# Altium project CryptUS_RevB.PrjPcb (part 1 of 2)
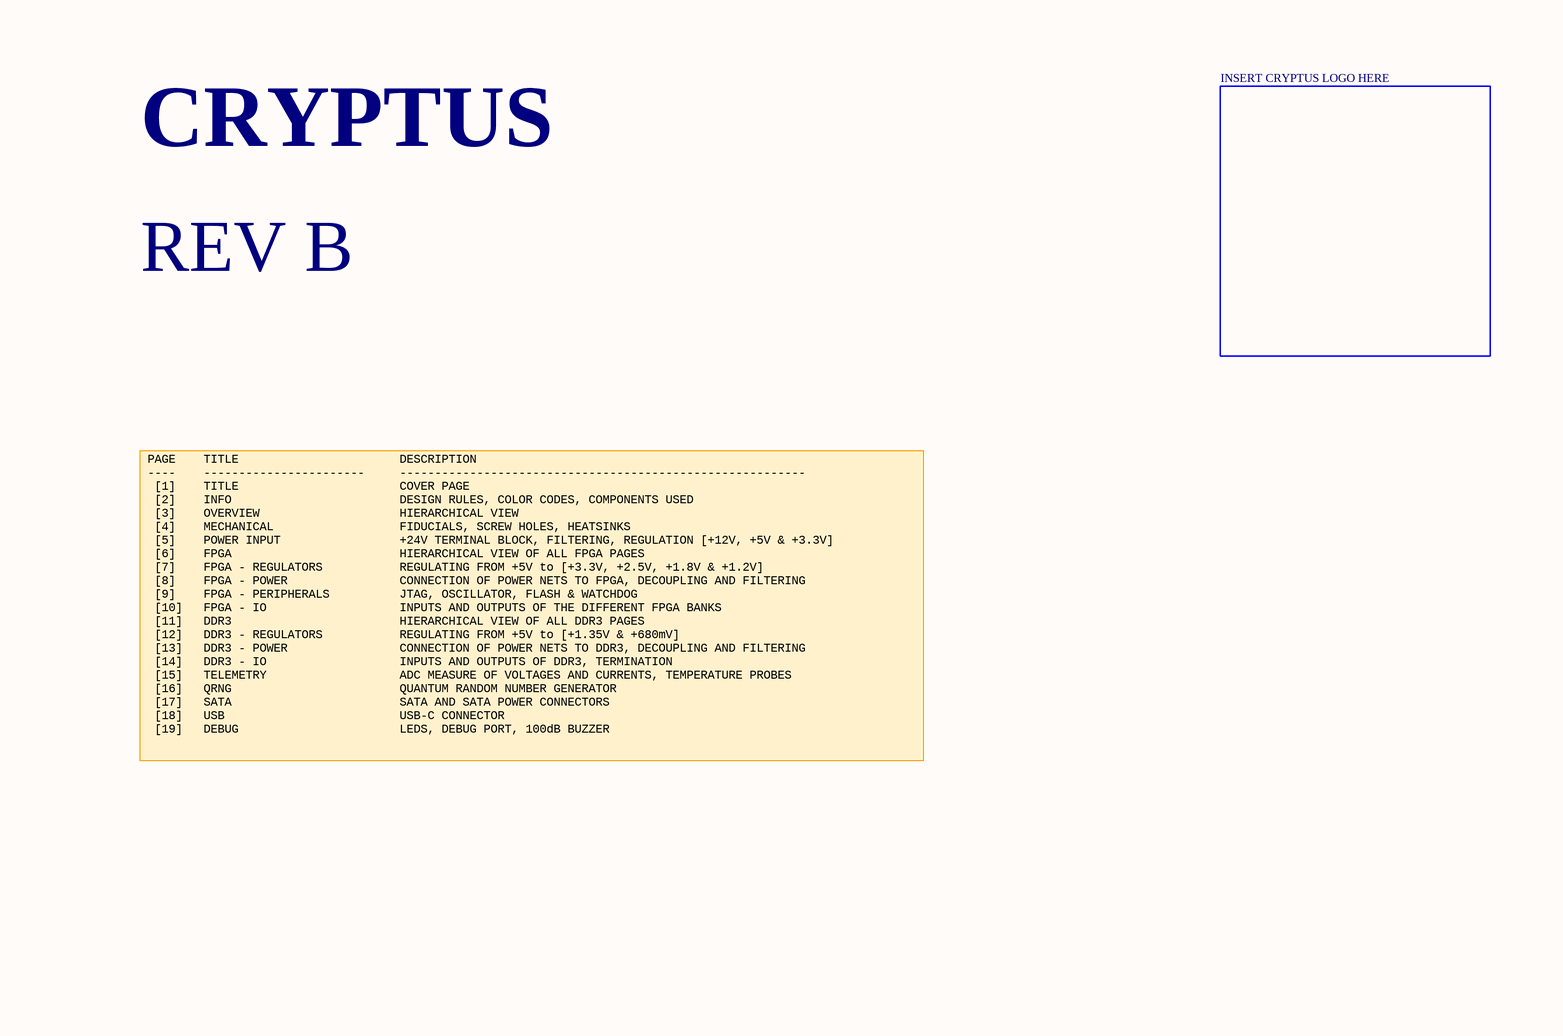
[diagram p0: TITLE.SchDoc]
Author: Pascal-Emmanuel Lachance; DOC_NO_ASSY_DWG: CryptUS_RevB_DWG.PCBDwf; DOC_NO_BOM: CryptUS_RevB_BOM.xslx; NotFitted: DNF; PCB_DWG_NO: CryptUS_RevB_PCB.PcbDoc; Project: CryptUS; Revision: B; SCH_SCALE: 1:1
19 sheets, 226 parts. Net scope: hierarchical (ports join the sheet entries above them; power ports are global).
Board file: CryptUS_RevB_PCB.PcbDoc
Sheets:
  TITLE.SchDoc
    INFO PAGE = INFO.SchDoc
    INSERT CRYPTUS LOGO HERE = OVERVIEW.SchDoc
      MECHANICAL = MECHANICAL.SchDoc
      POWER IN = POWER INPUT.SchDoc
      LATTICE ECP5 FPGA = FPGA.SchDoc
        [+5V] => [+3V3, +2V5, +1V8, +1V2] = FPGA - REGULATORS.SchDoc
        FPGA POWER INPUTS = FPGA - POWER.SchDoc
        FPGA IO BANKS = FPGA - IO.SchDoc
        JTAG, OSCILLATOR, FLASH & WATCHDOG = FPGA - PERIPHERALS.SchDoc
      8GB DDR3 = DDR3.SchDoc
        [+5V] => [+1V35, +VTT, +VREF] = DDR3 - REGULATORS.SchDoc
        DDR3 POWER INPUTS = DDR3 - POWER.SchDoc
        DDR3 IO & TERMINATIONS = DDR3 - IO.SchDoc
      TELEMTRY = TELEMETRY.SchDoc
      QUANTUM FUCKERY = QRNG.SchDoc
      DEBUG = DEBUG.SchDoc
      SATA1 = SATA.SchDoc
      SATA2 = SATA.SchDoc
      USB1 = USB.SchDoc
      USB2 = USB.SchDoc

## Sheet TITLE.SchDoc: TITLE
size A4; DocumentNumber: 1; SheetNumber: 1; SheetTotal: 19; DOC_NO_SCH_DWG: Title.SchDoc

### Sub-sheets
INFO PAGE = INFO.SchDoc: no entries
INSERT CRYPTUS LOGO HERE = OVERVIEW.SchDoc: no entries

### Notes on the sheet
- CRYPTUS
- REV B
- PAGE    TITLE                       DESCRIPTION
  ----    -----------------------     ----------------------------------------------------------
  [1]    TITLE                       COVER PAGE
  [2]    INFO                        DESIGN RULES, COLOR CODES, COMPONENTS USED
  [3]    OVERVIEW                    HIERARCHICAL VIEW
  [4]    MECHANICAL                  FIDUCIALS, SCREW HOLES, HEATSINKS
  [5]    POWER INPUT                 +24V TERMINAL BLOCK, FILTERING, REGULATION [+12V, +5V & +3.3V]
  [6]    FPGA                        HIERARCHICAL VIEW OF ALL FPGA PAGES
  [7]    FPGA - REGULATORS           REGULATING FROM +5V to [+3.3V, +2.5V, +1.8V & +1.2V]
  [8]    FPGA - POWER                CONNECTION OF POWER NETS TO FPGA, DECOUPLING AND FILTERING
  [9]    FPGA - PERIPHERALS          JTAG, OSCILLATOR, FLASH & WATCHDOG
  [10]   FPGA - IO                   INPUTS AND OUTPUTS OF THE DIFFERENT FPGA BANKS
  [11]   DDR3                        HIERARCHICAL VIEW OF ALL DDR3 PAGES
  [12]   DDR3 - REGULATORS           REGULATING FROM +5V to [+1.35V & +680mV]
  [13]   DDR3 - POWER                CONNECTION OF POWER NETS TO DDR3, DECOUPLING AND FILTERING
  [14]   DDR3 - IO                   INPUTS AND OUTPUTS OF DDR3, TERMINATION
  [15]   TELEMETRY                   ADC MEASURE OF VOLTAGES AND CURRENTS, TEMPERATURE PROBES
  [16]   QRNG                        QUANTUM RANDOM NUMBER GENERATOR
  [17]   SATA                        SATA AND SATA POWER CONNECTORS
  [18]   USB                         USB-C CONNECTOR
  [19]   DEBUG                       LEDS, DEBUG PORT, 100dB BUZZER
- THIS DOCUMENT AND THE DATA DISCLOSED HEREIN OR
- HEREWITH IS THE PROPERTY OF ALTIUM LIMITED AND MAY
- DWG NO:
- REVISION
- REV:
- DESCRIPTION
- DATE
- APPROVED
- BE FREELY DISTRIBUTED IN WHOLE. NO RIGHTS ARE
- RESERVED OR EXPRESS OR IMPLIED WARANTEE GIVEN.
- ENG:
- APPROVALS
- PROJECT
- DSN:
- CHK:
- REFERENCE DOCUMENTS
- PROJECT REVISION:
- TITLE
- DOCUMENT REVISION:
- DESIGN ITEM:
- BOM:
- FAB DWG:
- PCB DWG:
- ASSY DWG:
- SCALE:
- A3
- SIZE
- CAGE CODE
- FILE NAME
- DWG NO.
- SHEET
- OF
- REV

## Sheet INFO.SchDoc
size A3; DocumentNumber: 2; SheetNumber: 2; SheetTotal: 19
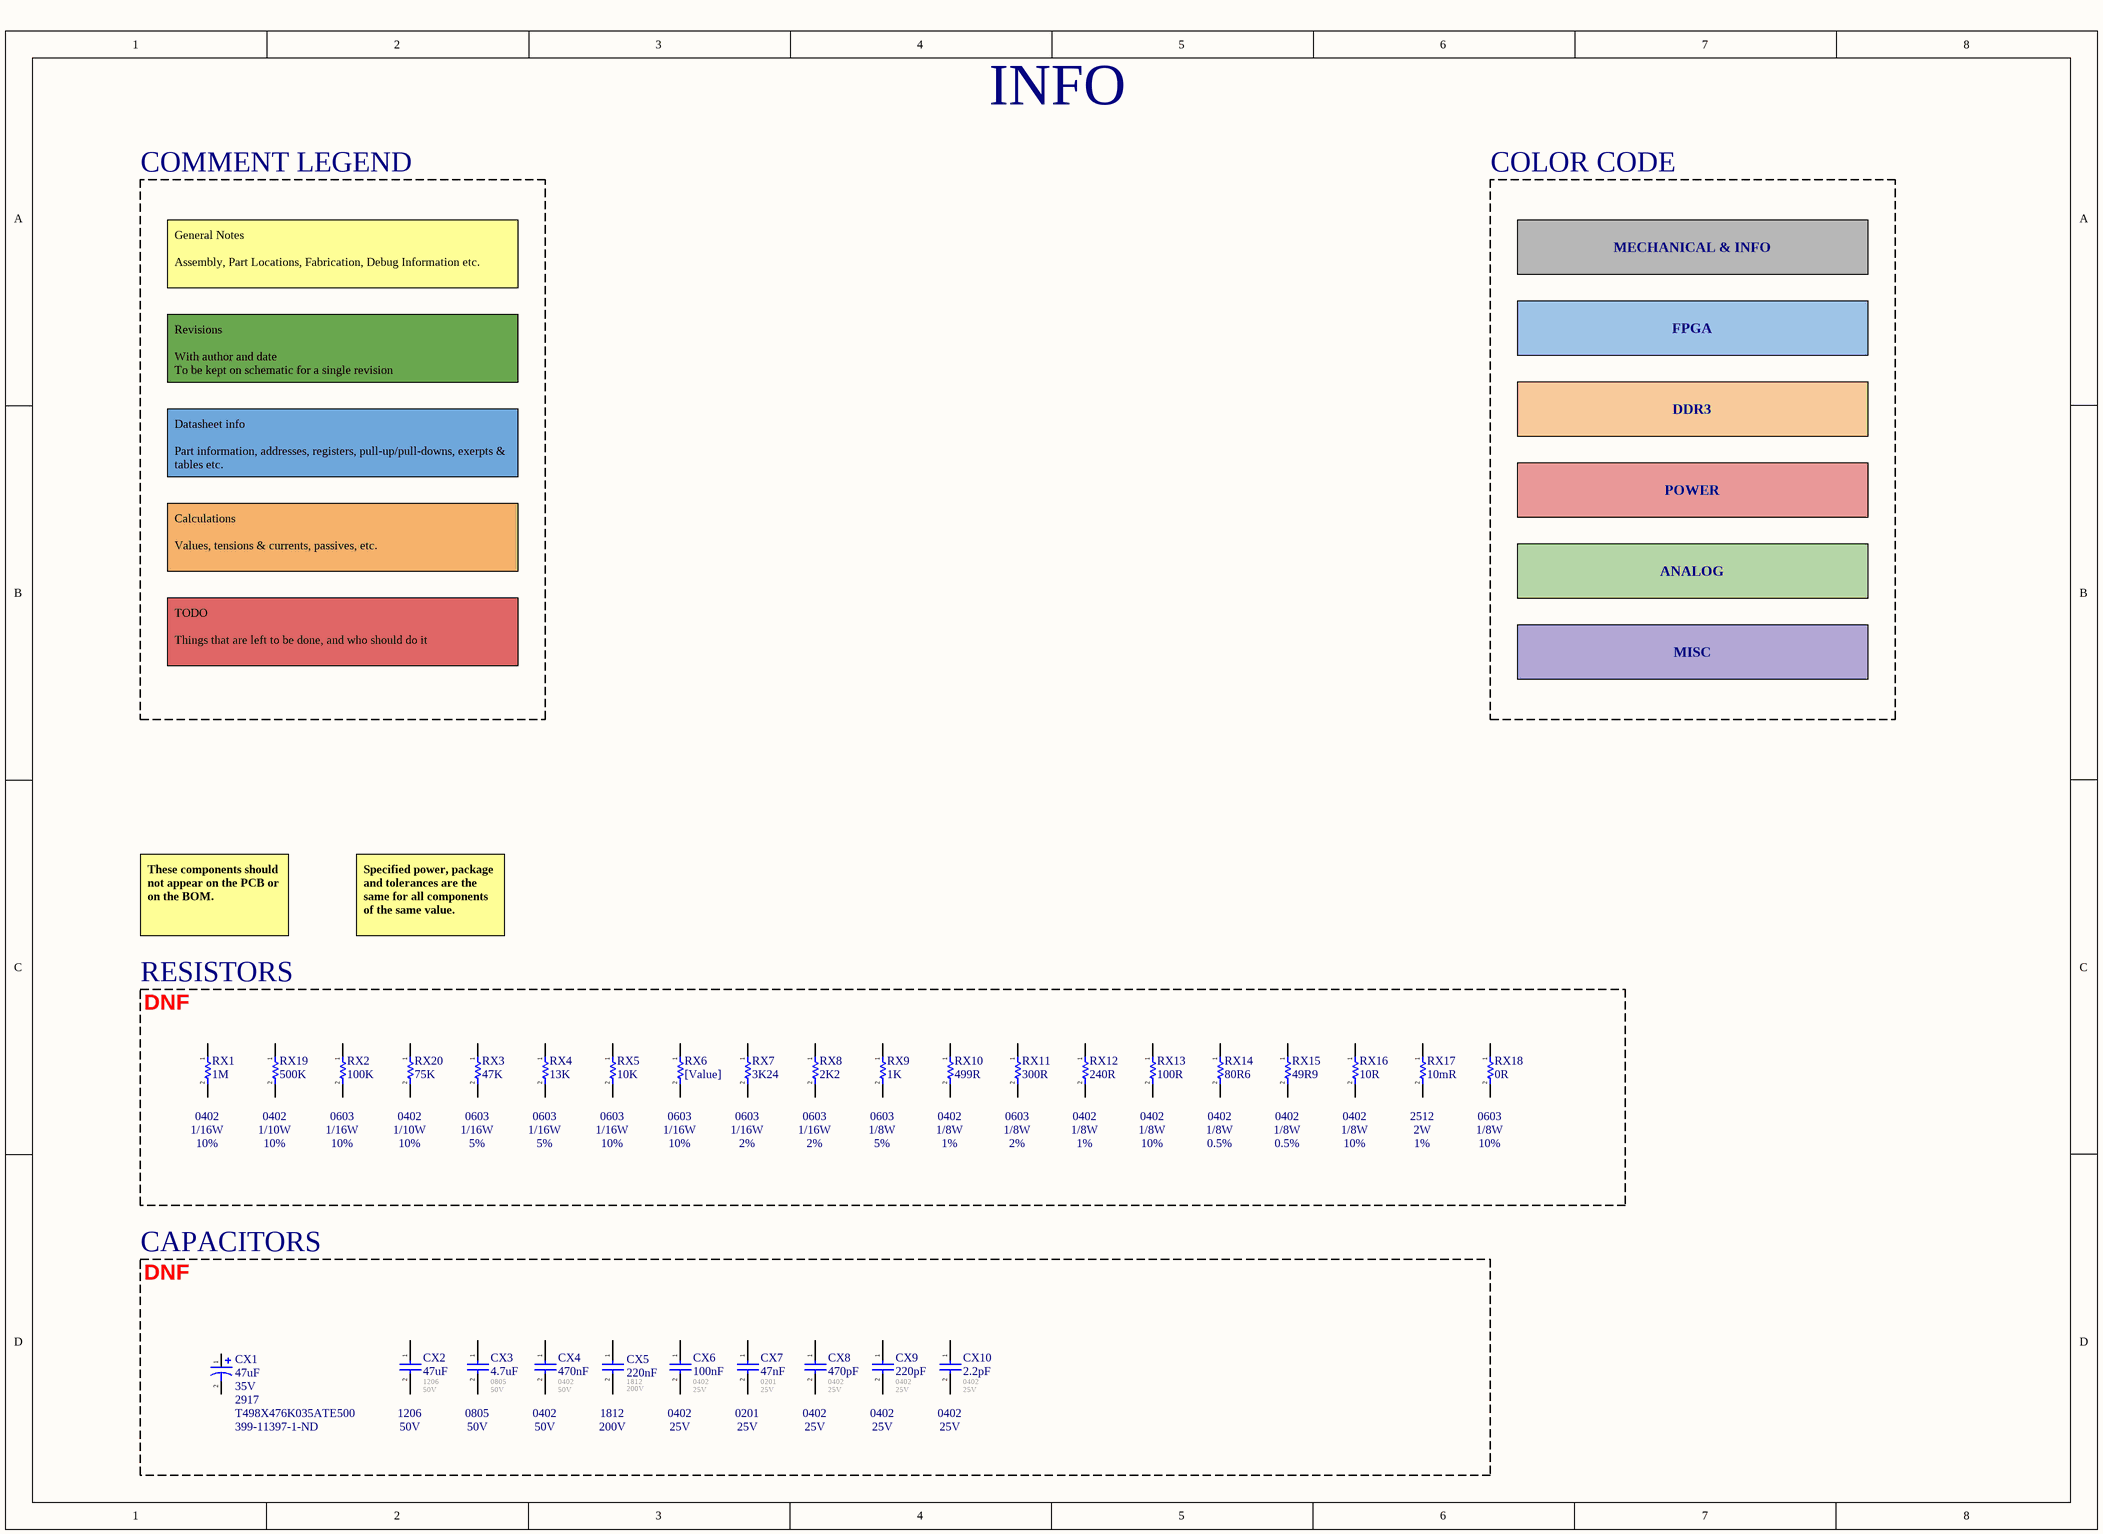
[diagram p1: INFO.SchDoc]

### Parts
CX1  47uF  Part #: T498X476K035ATE500  Rated Voltage: 35V  Supplier Part Number 1: 399-11397-1-ND  Package: 2917  [CAP_2917_P]
CX2  47uF  Footprint: 1206  Voltage - Rated: 50V  [CAP_1206]
CX3  4.7uF  Footprint: 0805  Voltage - Rated: 50V  [CAP_0805]
CX4  470nF  Footprint: 0402  Voltage - Rated: 50V  [CAP_0402]
CX5  220nF  Voltage - Rated: 200V  Footprint: 1812  [CAP_1812]
CX6  100nF  Footprint: 0402  Voltage - Rated: 25V  [CAP_0402]
CX7  47nF  Footprint: 0201  Voltage - Rated: 25V  [CAP_0201]
CX8  470pF  Footprint: 0402  Voltage - Rated: 25V  [CAP_0402]
CX9  220pF  Footprint: 0402  Voltage - Rated: 25V  [CAP_0402]
CX10  2.2pF  Footprint: 0402  Voltage - Rated: 25V  [CAP_0402]
RX1  1M  [RES_0402]
RX2  100K  [RES_0603]
RX3  47K  [RES_0603]
RX4  13K  [RES_0603]
RX5  10K  [RES_0603]
RX6  [Value]  [RES_0603]
RX7  3K24  [RES_0603]
RX8  2K2  [RES_0603]
RX9  1K  [RES_0603]
RX10  499R  [RES_0402]
RX11  300R  [RES_0603]
RX12  240R  [RES_0402]
RX13  100R  [RES_0402]
RX14  80R6  [RES_0402]
RX15  49R9  [RES_0402]
RX16  10R  [RES_0402]
RX17  10mR  [RES_2512]
RX18  0R  [RES_0603]
RX19  500K  [RES_0402]
RX20  75K  [RES_0402]

### Blocks framed on the sheet
RESISTORS: RX1-RX20
CAPACITORS: CX1-CX10

### Nets

Not connected (* = marked no-connect by the designer): CX1 1 2; CX2 1 2; CX3 1 2; CX4 1 2; CX5 1 2; CX6 1 2; CX7 1 2; CX8 1 2; CX9 1 2; CX10 1 2; RX1 1 2; RX2 1 2; RX3 1 2; RX4 1 2; RX5 1 2; RX6 1 2; RX7 1 2; RX8 1 2; RX9 1 2; RX10 1 2; RX11 1 2; RX12 1 2; RX13 1 2; RX14 1 2; RX15 1 2; RX16 1 2; RX17 1 2; RX18 1 2; RX19 1 2; RX20 1 2

### Notes on the sheet
- INFO
- COMMENT LEGEND
- COLOR CODE
- MECHANICAL & INFO
- General Notes
  Assembly, Part Locations, Fabrication, Debug Information etc.
- FPGA
- Revisions
  With author and date
  To be kept on schematic for a single revision
- DDR3
- Datasheet info
  Part information, addresses, registers, pull-up/pull-downs, exerpts & tables etc.
- POWER
- Calculations
  Values, tensions & currents, passives, etc.
- ANALOG
- TODO
  Things that are left to be done, and who should do it
- MISC
- These components should not appear on the PCB or on the BOM.
- Specified power, package and tolerances are the same for all components of the same value.
- (near RX1) 0402
- (near RX1) 1/16W
- 10%
- (near RX19) 0402
- (near RX19) 1/10W
- (near RX2) 0603
- (near RX2) 1/16W
- (near RX20) 0402
- (near RX20) 1/10W
- (near RX3) 0603
- (near RX3) 1/16W
- 5%
- (near RX4) 0603
- (near RX4) 1/16W
- (near RX5) 0603
- (near RX5) 1/16W
- (near RX6) 0603
- (near RX6) 1/16W
- (near RX7) 0603
- (near RX7) 1/16W
- 2%
- (near RX8) 0603
- (near RX8) 1/16W
- (near RX9) 0603
- (near RX9) 1/8W
- (near RX10) 0402
- (near RX10) 1/8W
- 1%
- (near RX11) 0603
- (near RX11) 1/8W
- (near RX12) 0402
- (near RX12) 1/8W
- (near RX13) 0402
- (near RX13) 1/8W
- (near RX14) 0402
- (near RX14) 1/8W
- 0.5%
- (near RX15) 0402
- (near RX15) 1/8W
- (near RX16) 0402
- (near RX16) 1/8W
- (near RX17) 2512
- (near RX17) 2W
- (near RX18) 0603
- (near RX18) 1/8W
- (near CX2) 1206
- (near CX3) 0805
- (near CX4) 0402
- (near CX5) 1812
- (near CX6) 0402
- (near CX7) 0201
- (near CX8) 0402
- (near CX9) 0402
- (near CX10) 0402
- (near CX2) 50V
- (near CX3) 50V
- (near CX4) 50V
- (near CX5) 200V
- (near CX6) 25V
- (near CX7) 25V
- (near CX8) 25V
- (near CX9) 25V
- (near CX10) 25V

### Library data of the parts
CX1 = CAP_T498X476K035ATE500: 47 µF Molded Tantalum Capacitors 35 V 2917 (7343 Metric) 500mOhm; Mfr: KEMET; Tolerance: 10%; Operating Temperature: -55C - 150C; Supplier 1: Digi-Key
CX2-CX10 = CAP_CER: Generic SMT Ceramic Capacitor; Operating Temperature: *; Tolerance: *; Mfr: *; ComponentLink1Description: Digikey; ComponentLink1URL: [Digikey Link]; Digikey Part No: *; ComponentLink2Description: Datasheet; ComponentLink2URL: [Datasheet Link]
RX1 RX2 RX5 = RESISTOR: Power: 1/16W; Tolerance: 10%; Automotive: *; Operating Temperature: *; # Digikey: *; ComponentLink1Description: Digikey; ComponentLink1URL: *; # Manufacturer: *; Package / Case: 0603
RX3 RX9 = RESISTOR: Power: 1/8W; Tolerance: 5%; Automotive: *; Operating Temperature: *; # Digikey: *; ComponentLink1Description: Digikey; ComponentLink1URL: *; # Manufacturer: *; Package / Case: 0603
RX4 = RESISTOR: Power: 1/16W; Tolerance: 5%; Automotive: *; Operating Temperature: *; # Digikey: *; ComponentLink1Description: Digikey; ComponentLink1URL: *; # Manufacturer: *; Package / Case: 0603
RX6 = RESISTOR: Power: [Power]; Tolerance: [Tolerance]; Automotive: *; Operating Temperature: *; # Digikey: *; ComponentLink1Description: Digikey; ComponentLink1URL: *; # Manufacturer: *; Package / Case: [Package]
RX7 RX8 = RESISTOR: Power: 1/16W; Tolerance: 2%; Automotive: *; Operating Temperature: *; # Digikey: *; ComponentLink1Description: Digikey; ComponentLink1URL: *; # Manufacturer: *; Package / Case: 0603
RX10 RX12 = RESISTOR: Power: 1/8W; Tolerance: 1%; Automotive: *; Operating Temperature: *; # Digikey: *; ComponentLink1Description: Digikey; ComponentLink1URL: *; # Manufacturer: *; Package / Case: 0402
RX11 = RESISTOR: Power: 1/8W; Tolerance: 2%; Automotive: *; Operating Temperature: *; # Digikey: *; ComponentLink1Description: Digikey; ComponentLink1URL: *; # Manufacturer: *; Package / Case: 0603
RX13 RX16 RX18 = RESISTOR: Power: 1/8W; Tolerance: 10%; Automotive: *; Operating Temperature: *; # Digikey: *; ComponentLink1Description: Digikey; ComponentLink1URL: *; # Manufacturer: *
  RX13 RX16: Package / Case: 0402
  RX18: Package / Case: 0603
RX14 RX15 = RESISTOR: Power: 1/8W; Tolerance: 0.5%; Automotive: *; Operating Temperature: *; Package / Case: 0402; # Digikey: *; ComponentLink1Description: Digikey; ComponentLink1URL: *; # Manufacturer: *
RX17 = RESISTOR: Power: 2W; Tolerance: 1%; Automotive: *; Operating Temperature: *; # Digikey: *; ComponentLink1Description: Digikey; ComponentLink1URL: *; # Manufacturer: *; Package / Case: 2512
RX19 RX20 = RESISTOR: Power: 1/10W; Tolerance: 10%; Automotive: *; Operating Temperature: *; # Digikey: *; ComponentLink1Description: Digikey; ComponentLink1URL: *; # Manufacturer: *; Package / Case: 0402

## Sheet OVERVIEW.SchDoc
size A3; DocumentNumber: 3; SheetNumber: 3; SheetTotal: 19
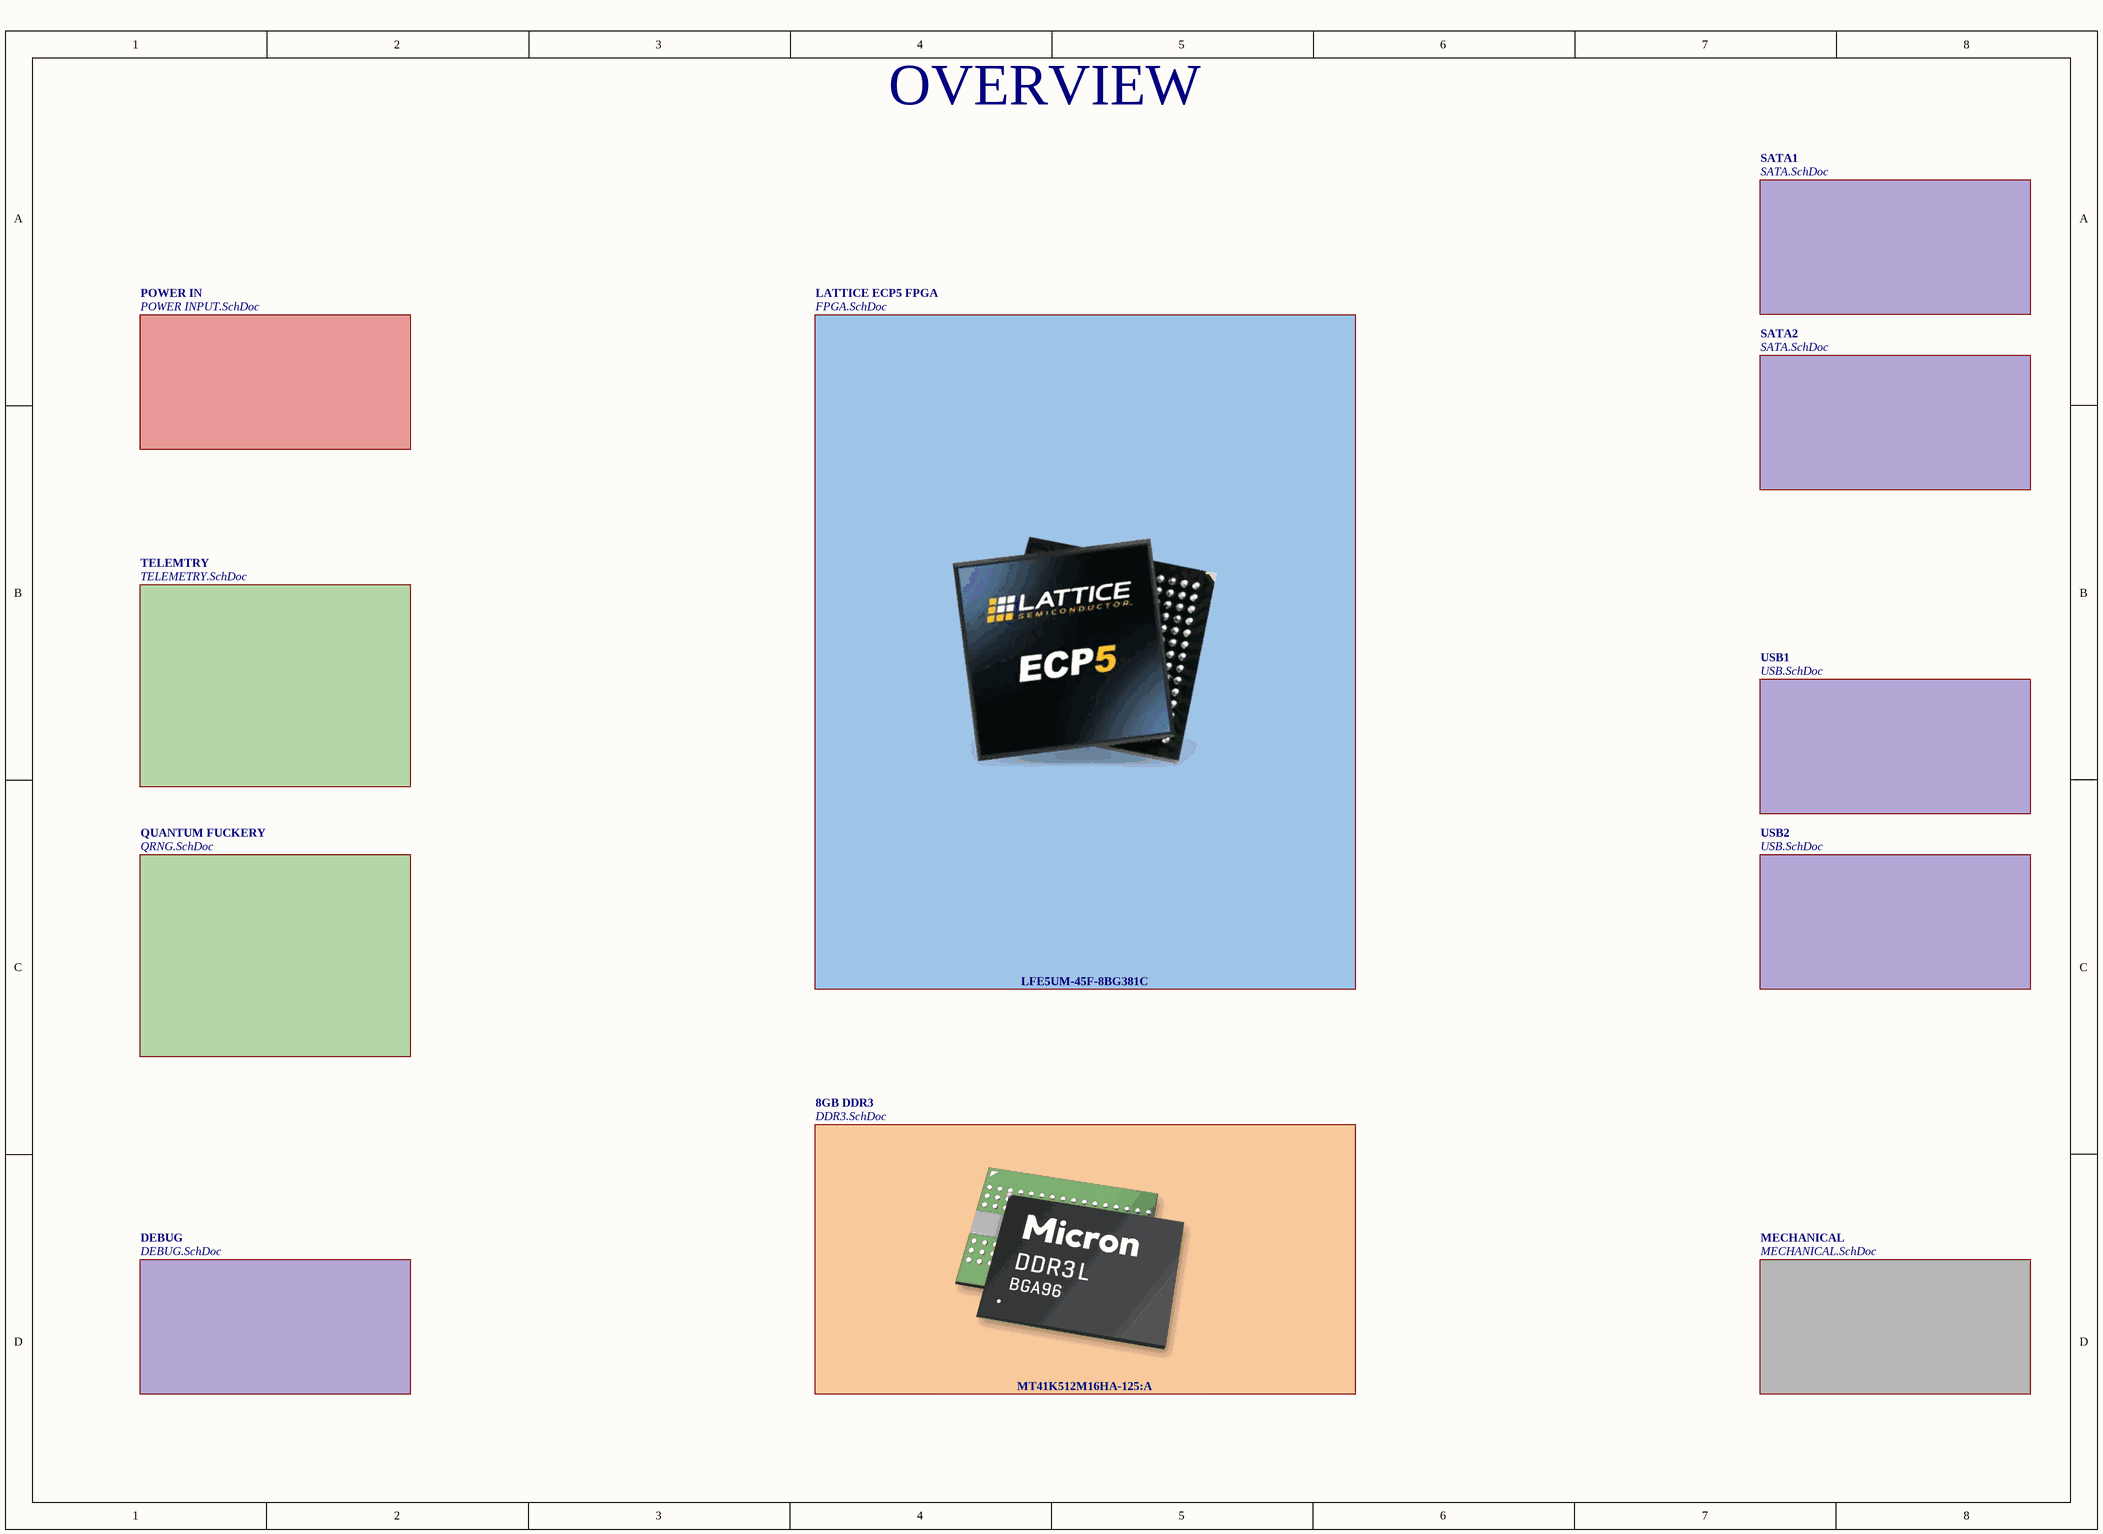
[diagram p2: OVERVIEW.SchDoc]

### Sub-sheets
8GB DDR3 = DDR3.SchDoc: no entries
DEBUG = DEBUG.SchDoc: no entries
LATTICE ECP5 FPGA = FPGA.SchDoc: no entries
MECHANICAL = MECHANICAL.SchDoc: no entries
POWER IN = POWER INPUT.SchDoc: no entries
QUANTUM FUCKERY = QRNG.SchDoc: no entries
SATA1 = SATA.SchDoc: no entries
SATA2 = SATA.SchDoc: no entries
TELEMTRY = TELEMETRY.SchDoc: no entries
USB1 = USB.SchDoc: no entries
USB2 = USB.SchDoc: no entries

### Notes on the sheet
- OVERVIEW
- LFE5UM-45F-8BG381C
- MT41K512M16HA-125:A

## Sheet MECHANICAL.SchDoc
size A4; DocumentNumber: 4; SheetNumber: 4; SheetTotal: 19
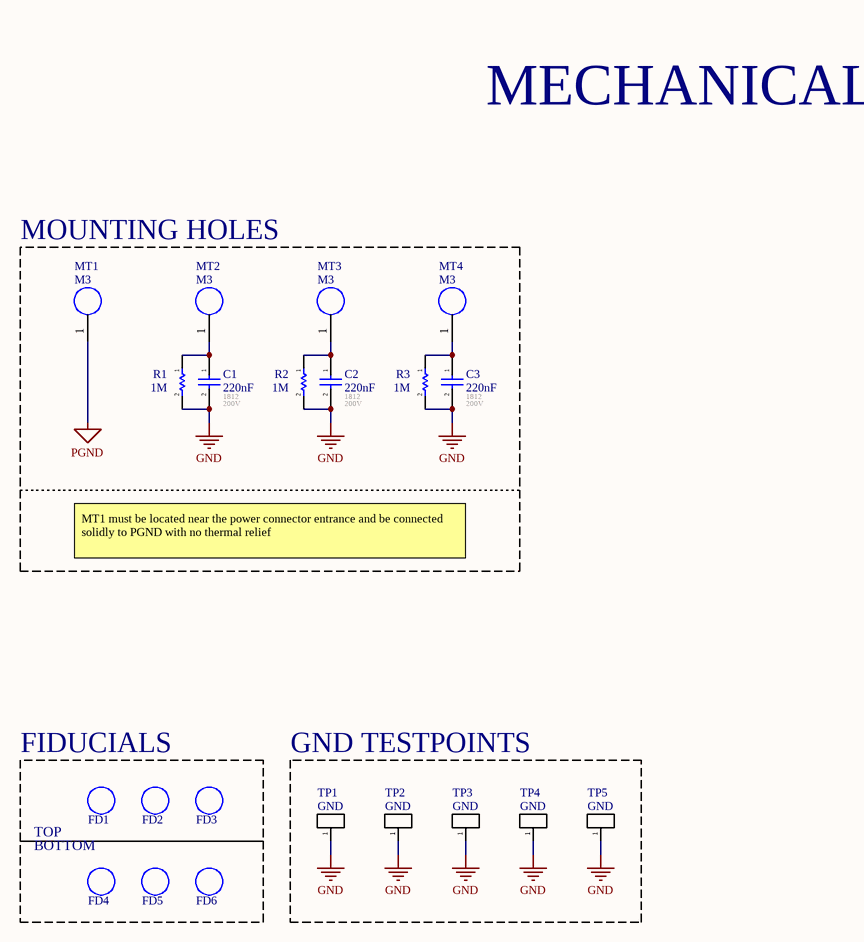
[diagram p3: MECHANICAL.SchDoc]

### Parts
C1  220nF  Voltage - Rated: 200V  Footprint: 1812  [CAP_1812]
C2  220nF  Voltage - Rated: 200V  Footprint: 1812  [CAP_1812]
C3  220nF  Voltage - Rated: 200V  Footprint: 1812  [CAP_1812]
FD1  FIDUCIAL  [FIDUCIAL]  (value not drawn)  (no BOM)
FD2  FIDUCIAL  [FIDUCIAL]  (value not drawn)  (no BOM)
FD3  FIDUCIAL  [FIDUCIAL]  (value not drawn)  (no BOM)
FD4  FIDUCIAL  [FIDUCIAL]  (value not drawn)  (no BOM)
FD5  FIDUCIAL  [FIDUCIAL]  (value not drawn)  (no BOM)
FD6  FIDUCIAL  [FIDUCIAL]  (value not drawn)  (no BOM)
MT1  M3  [MTH_M3]
MT2  M3  [MTH_M3]
MT3  M3  [MTH_M3]
MT4  M3  [MTH_M3]
R1  1M  [RES_0402]
R2  1M  [RES_0402]
R3  1M  [RES_0402]
TP1  GND  [TP_HOLE]  (no BOM)
TP2  GND  [TP_HOLE]  (no BOM)
TP3  GND  [TP_HOLE]  (no BOM)
TP4  GND  [TP_HOLE]  (no BOM)
TP5  GND  [TP_HOLE]  (no BOM)

### Blocks framed on the sheet
MOUNTING HOLES: C1-C3 MT1-MT4 R1-R3
FIDUCIALS: FD1-FD6
GND TESTPOINTS: TP1-TP5

### Nets
GND: C1.2 C2.2 C3.2 R1.2 R2.2 R3.2 TP1.1(A) TP2.1(A) TP3.1(A) TP4.1(A) TP5.1(A)
PGND: MT1.1
NetC1_1: C1.1 MT2.1 R1.1
NetC2_1: C2.1 MT3.1 R2.1
NetC3_1: C3.1 MT4.1 R3.1

### Notes on the sheet
- MECHANICAL
- MT1 must be located near the power connector entrance and be connected solidly to PGND with no thermal relief
- (near FD4) BOTTOM
- TOP

### Library data of the parts
C1-C3 = CAP_CER: Generic SMT Ceramic Capacitor; Operating Temperature: *; Tolerance: *; Mfr: *; ComponentLink1Description: Digikey; ComponentLink1URL: [Digikey Link]; Digikey Part No: *; ComponentLink2Description: Datasheet; ComponentLink2URL: [Datasheet Link]
MT1-MT4 = MOUNTING_HOLE
R1-R3 = RESISTOR: Power: 1/16W; Tolerance: 10%; Automotive: *; Operating Temperature: *; # Digikey: *; ComponentLink1Description: Digikey; ComponentLink1URL: *; # Manufacturer: *; Package / Case: 0603
TP1-TP5 = TESTPOINT: Test Point

## Sheet POWER INPUT.SchDoc
size A2; DocumentNumber: 5; SheetNumber: 5; SheetTotal: 19
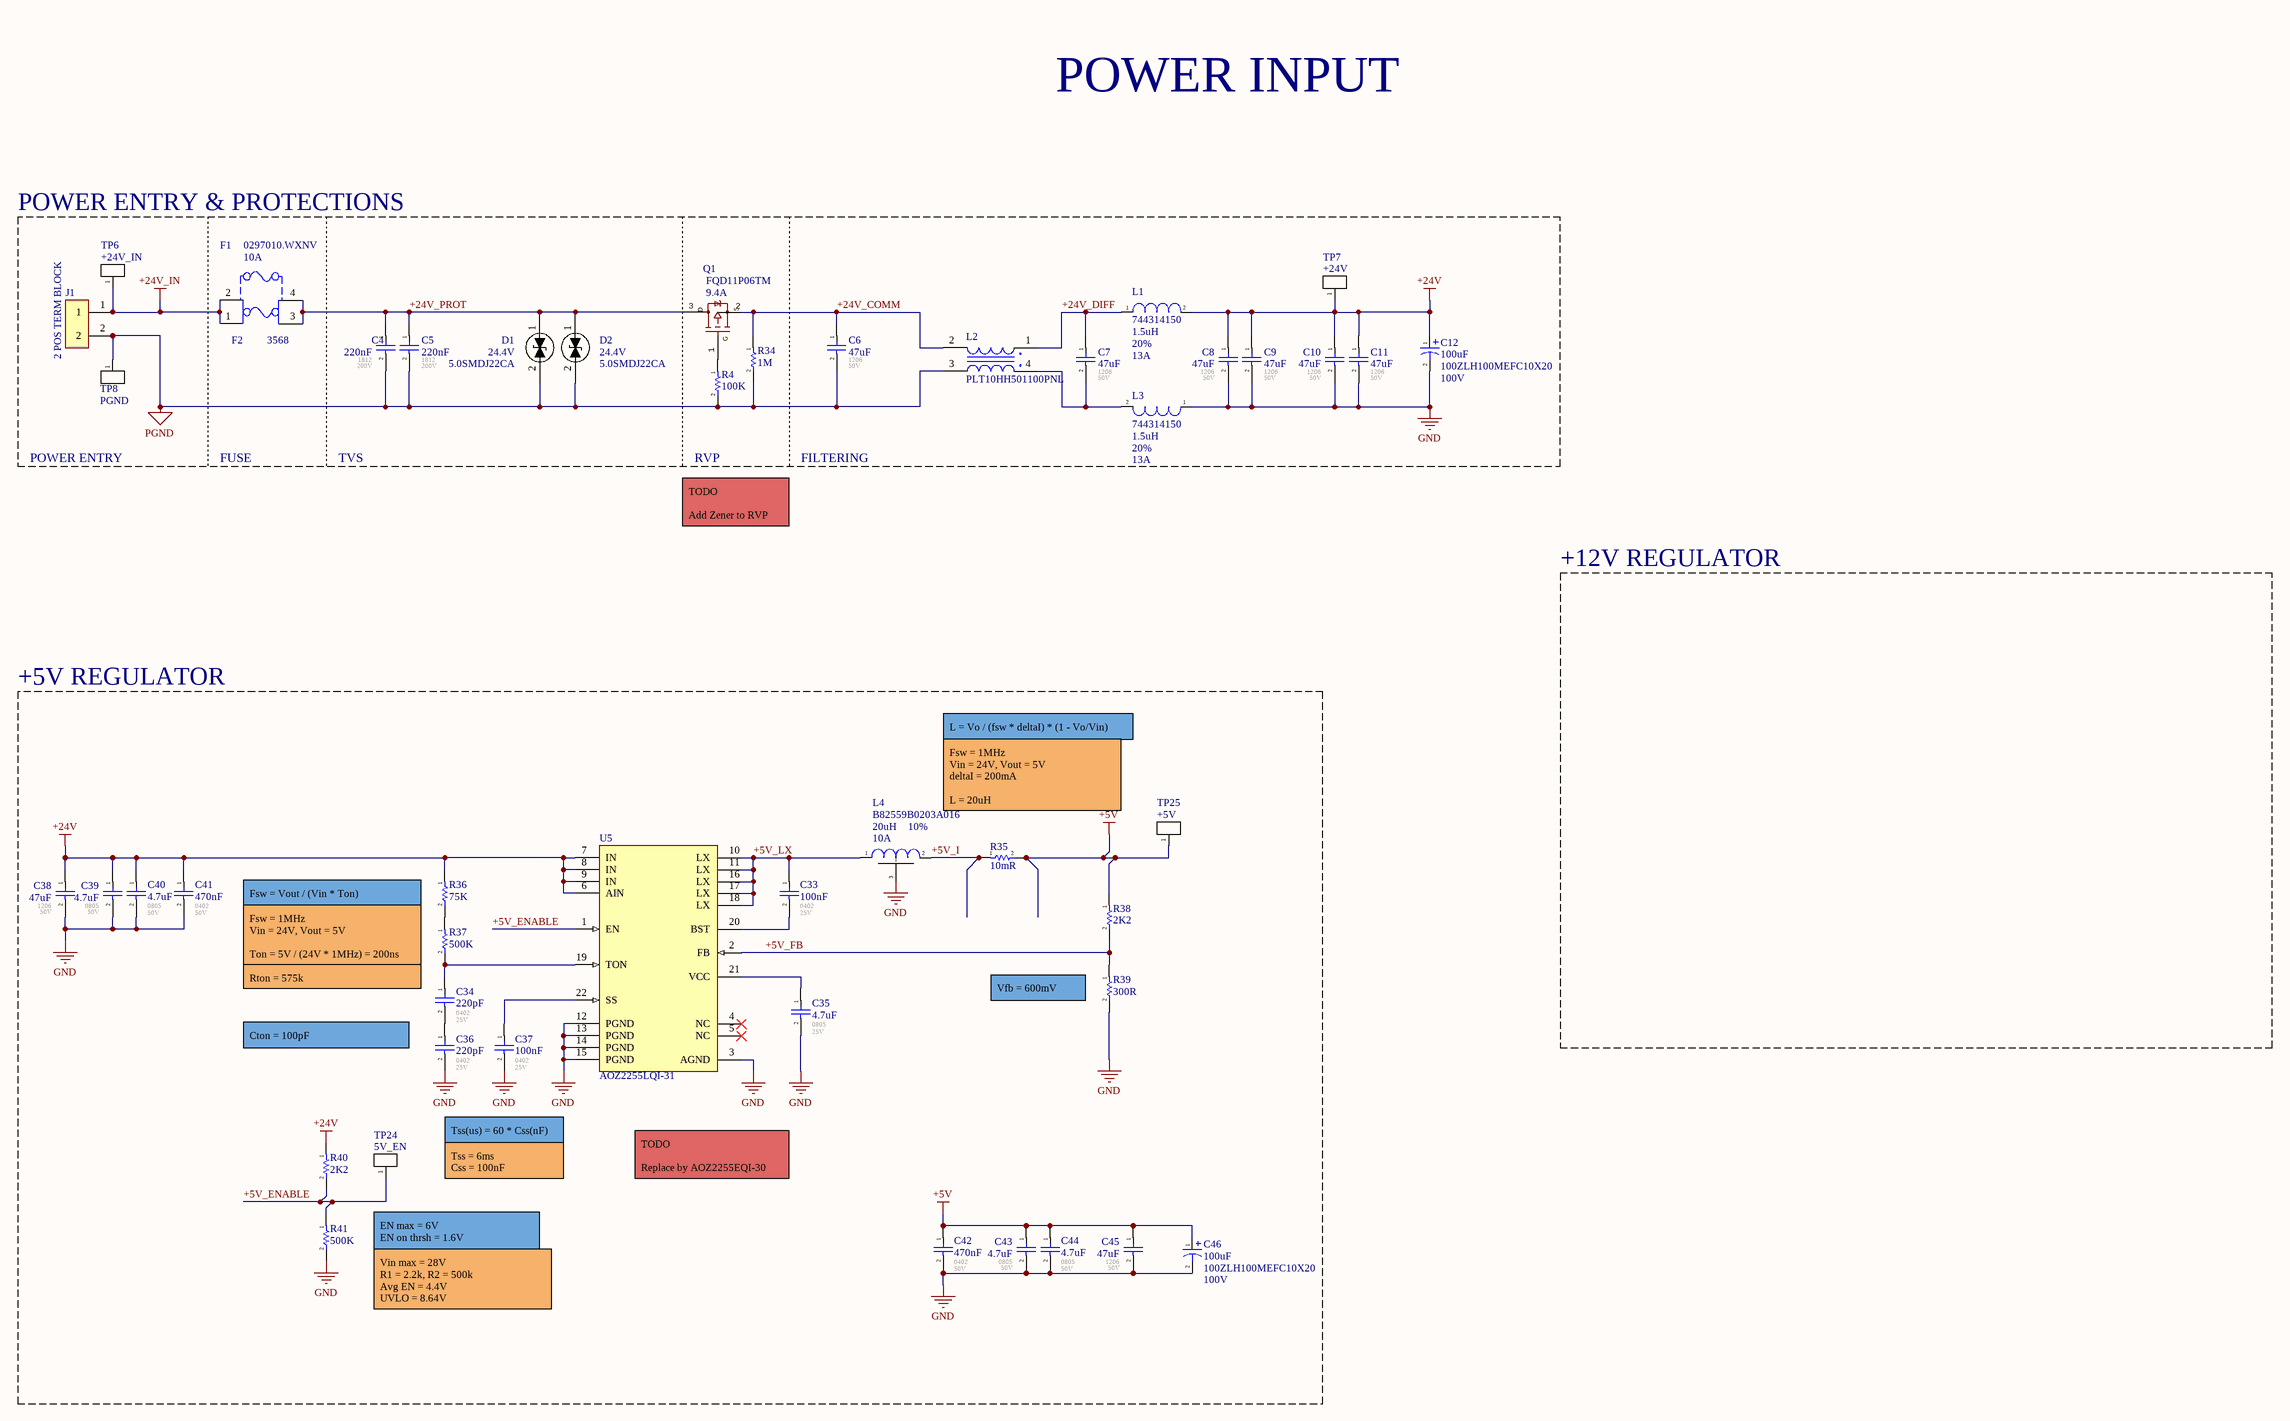
[diagram p4: POWER INPUT.SchDoc]

### Parts
C4  220nF  Voltage - Rated: 200V  Footprint: 1812  [CAP_1812]
C5  220nF  Voltage - Rated: 200V  Footprint: 1812  [CAP_1812]
C6  47uF  Footprint: 1206  Voltage - Rated: 50V  [CAP_1206]
C7  47uF  Footprint: 1206  Voltage - Rated: 50V  [CAP_1206]
C8  47uF  Footprint: 1206  Voltage - Rated: 50V  [CAP_1206]
C9  47uF  Footprint: 1206  Voltage - Rated: 50V  [CAP_1206]
C10  47uF  Footprint: 1206  Voltage - Rated: 50V  [CAP_1206]
C11  47uF  Footprint: 1206  Voltage - Rated: 50V  [CAP_1206]
C12  100uF  Rated Voltage: 100V  [100ZLH100MEFC10X20]
C33  100nF  Footprint: 0402  Voltage - Rated: 25V  [CAP_0402]
C34  220pF  Footprint: 0402  Voltage - Rated: 25V  [CAP_0402]
C35  4.7uF  Footprint: 0805  Voltage - Rated: 25V  [CAP_0805]
C36  220pF  Footprint: 0402  Voltage - Rated: 25V  [CAP_0402]
C37  100nF  Footprint: 0402  Voltage - Rated: 25V  [CAP_0402]
C38  47uF  Footprint: 1206  Voltage - Rated: 50V  [CAP_1206]
C39  4.7uF  Footprint: 0805  Voltage - Rated: 50V  [CAP_0805]
C40  4.7uF  Footprint: 0805  Voltage - Rated: 50V  [CAP_0805]
C41  470nF  Footprint: 0402  Voltage - Rated: 50V  [CAP_0402]
C42  470nF  Footprint: 0402  Voltage - Rated: 50V  [CAP_0402]
C43  4.7uF  Footprint: 0805  Voltage - Rated: 50V  [CAP_0805]
C44  4.7uF  Footprint: 0805  Voltage - Rated: 50V  [CAP_0805]
C45  47uF  Footprint: 1206  Voltage - Rated: 50V  [CAP_1206]
C46  100uF  Rated Voltage: 100V  [100ZLH100MEFC10X20]
D1  5.0SMDJ22CA  Voltage - Breakdown: 24.4V  [DO214AB (SMC)]
D2  5.0SMDJ22CA  Voltage - Breakdown: 24.4V  [DO214AB (SMC)]
F1  0297010.WXNV  Current - Trip: 10A  [0297010.WXNV]
F2  3568  [3568]
J1  2 POS TERM BLOCK  [TERM-2_90_100MIL]
L1  744314150  Inductance: 1.5uH  Tolerance: 20%  Current Rating: 13A  [744314150]
L2  PLT10HH501100PNL  [PLT10HH501100PNL]
L3  744314150  Inductance: 1.5uH  Tolerance: 20%  Current Rating: 13A  [744314150]
L4  B82559B0203A016  Inductance: 20uH  Tolerance: 10%  Current Rating: 10A  [B82559B0203A016]
Q1  FQD11P06TM  Current: 9.4A  [FQD11P06TM]
R4  100K  [RES_0603]
R34  1M  [RES_0402]
R35  10mR  [RES_2512]
R36  75K  [RES_0402]
R37  500K  [RES_0402]
R38  2K2  [RES_0603]
R39  300R  [RES_0603]
R40  2K2  [RES_0603]
R41  500K  [RES_0402]
TP6  +24V_IN  [TP_HOLE]  (no BOM)
TP7  +24V  [TP_HOLE]  (no BOM)
TP8  PGND  [TP_HOLE]  (no BOM)
TP24  5V_EN  [TP_PAD_SMALL]  (no BOM)
TP25  +5V  [TP_HOLE]  (no BOM)
U5  AOZ2255LQI-31  [AOZ2255LQI-31]

### Blocks framed on the sheet
POWER ENTRY & PROTECTIONS: C4-C12 D1 D2 F1 F2 J1 L1-L3 Q1 R4 R34 TP6-TP8
+5V REGULATOR: C33-C46 L4 R35-R41 TP24 TP25 U5

### Nets
+5V: C42.1 C43.1 C44.1 C45.1 C46.1 R35.2 R38.1 TP25.1(A)
+24V: C8.1 C9.1 C10.1 C11.1 C12.1 C38.1 C39.1 C40.1 C41.1 L1.2 R36.1 R40.1 TP7.1(A) U5.6(AIN) U5.7(IN) U5.8(IN) U5.9(IN)
+24V_IN: F2.1 F2.2 J1.1 TP6.1(A)
GND: C8.2 C9.2 C10.2 C11.2 C12.2 C35.2 C36.2 C37.2 C38.2 C39.2 C40.2 C41.2 C42.2 C43.2 C44.2 C45.2 C46.2 L3.1 L4.3(SHIELD) R39.2 R41.2 U5.3(AGND) U5.12(PGND) U5.13(PGND) U5.14(PGND) U5.15(PGND)
PGND: C4.2 C5.2 C6.2 D1.2(C) D2.2(C) J1.2 L2.3 R4.2 R34.2 TP8.1(A)
+5V_ENABLE: R40.2 R41.1 TP24.1(A) U5.1(EN)  [project net +5V_ENABLE_5]
+5V_FB: R38.2 R39.1 U5.2(FB)  [project net +5V_FB_5]
+5V_I: L4.2 R35.1  [project net +5V_I_5]
+5V_LX: C33.1 L4.1 U5.10(LX) U5.11(LX) U5.16(LX) U5.17(LX) U5.18(LX)  [project net +5V_LX_5]
+24V_COMM: C6.1 L2.2 Q1.2(S) R34.1  [project net +24V_COMM_5]
+24V_DIFF: C7.1 L1.1 L2.1  [project net +24V_DIFF_5]
+24V_PROT: C4.1 C5.1 D1.1(A) D2.1(A) F2.3 F2.4 Q1.3(D)  [project net +24V_PROT_5]
NetC7_2: C7.2 L2.4 L3.2
NetC33_2: C33.2 U5.20(BST)
NetC34_1: C34.1 R37.2 U5.19(TON)
NetC34_2: C34.2 C36.1
NetC35_1: C35.1 U5.21(VCC)
NetC37_1: C37.1 U5.22(SS)
NetQ1_1: Q1.1(G) R4.1
NetR36_2: R36.2 R37.1

Not connected (* = marked no-connect by the designer): U5 4(NC)* 5(NC)*

### Notes on the sheet
- POWER INPUT
- POWER ENTRY
- FUSE
- TVS
- RVP
- FILTERING
- TODO
  Add Zener to RVP
- +12V REGULATOR
- L = Vo / (fsw * deltaI) * (1 - Vo/Vin)
- Fsw = 1MHz
  Vin = 24V, Vout = 5V
  deltaI = 200mA
  L = 20uH
- Fsw = Vout / (Vin * Ton)
- Fsw = 1MHz
  Vin = 24V, Vout = 5V
  Ton = 5V / (24V * 1MHz) = 200ns
- Rton = 575k
- (near R39) Vfb = 600mV
- Cton = 100pF
- Tss(us) = 60 * Css(nF)
- Tss = 6ms
  Css = 100nF
- TODO
  Replace by AOZ2255EQI-30
- EN max = 6V
  EN on thrsh = 1.6V
- Vin max = 28V
  R1 = 2.2k, R2 = 500k
  Avg EN = 4.4V
  UVLO = 8.64V

### Library data of the parts
C4-C11 C33-C45 = CAP_CER: Generic SMT Ceramic Capacitor; Operating Temperature: *; Tolerance: *; Mfr: *; ComponentLink1Description: Digikey; ComponentLink1URL: [Digikey Link]; Digikey Part No: *; ComponentLink2Description: Datasheet; ComponentLink2URL: [Datasheet Link]
C12 C46 = CAP_100ZLH100MEFC10X20: CAP 100uF 20% 100V T/H; Mfr: Rubycon; Impedance: 120mR; Tolerance: 20%; Operating Temperature: -40C - 105C; ComponentLink1Description: Digikey; ComponentLink1URL: https://www.digikey.ca/en/products/detail/rubycon/100ZLH100MEFC10X20/3563824; ComponentLink2Description: Mouser; ComponentLink2URL: https://www.mouser.ca/ProductDetail/Rubycon/100ZLH100MEFC10X20; Digikey Part Number: 1189-1887-ND; Created By: Pascal-Emmanuel Lachance; ComponentLink3Description: Datasheet; ComponentLink3URL: https://www.rubycon.co.jp/wp-content/uploads/catalog-aluminum/ZLH.pdf; ComponentLink4Description: Octoparts; ComponentLink4URL: https://octopart.com/100zlh100mefc10x20-rubycon-19941711; Height: 22mm; Manufacturer Part Number: 100ZLH100MEFC10X20
D1 D2 = DIODE_5.0SMDJ22CA: TVS Diode 24.4V; Mfr: Littelfuse; Voltage - Reverse: 22V; Current: 141A Peak; Operating Temperature: -65C - 150C; Package / Case: SMC; Created By: Pascal-Emmanuel Lachance; ComponentLink1Description: Datasheet; ComponentLink1URL: https://www.littelfuse.com/~/media/electronics/datasheets/tvs_diodes/littelfuse_tvs_diode_5_0smdj_datasheet.pdf.pdf; ComponentLink2Description: Mfr page; ComponentLink2URL: https://www.littelfuse.com/products/tvs-diodes/surface-mount/5_0smdj/5_0smdj22ca.aspx; ComponentLink3Description: Digikey; ComponentLink3URL: https://www.digikey.ca/en/products/detail/littelfuse-inc/5-0SMDJ22CA/2024320; ComponentLink4Description: Mouser; ComponentLink4URL: https://www.mouser.ca/ProductDetail/Littelfuse/50SMDJ22CA; Supplier 1: Digi-Key; Supplier 2: Mouser; Supplier Part Number 1: F10850CT-ND; Supplier Part Number 2: 652-5.0SMDJ22CA
F1 = FUSE_0297010.WXNV: FUSE AUTO 10A 32V BLADE MINI; Mfr: Littelfuse; Current - Max: 40A; Time to Trip: 100ms; Resistance: 7.42mR; Rule: UNIONINDEX=0|RULEKIND=ComponentClearance|NETSCOPE=AnyNet|LAYERKIND=SameLayer|NAME=Schematic Component Clearance Constraint|GAP=-1mil|COLLISIONCHECKMODE=3|VERTICALGAP=10mil|SHOWDISTANCES=FALSE|UNIT=Imperial; Voltage Rating: 32V; Operating Temperature: -40C - 125C; Package / Case: BLADE MINI AUTO; Current - Hold: 10A; ComponentLink1Description: Datasheet; ComponentLink1URL: https://www.littelfuse.com/~/media/automotive/datasheets/fuses/passenger-car-and-commercial-vehicle/blade-fuses/littelfuse_mini_datasheet.pdf; ComponentLink2Description: Digikey; ComponentLink2URL: https://www.digikey.ca/en/products/detail/littelfuse-inc/0297010-WXNV/146591; Created By: Pascal-Emmanuel Lachance; ComponentLink3Description: Mouser; ComponentLink3URL: https://www.mouser.ca/ProductDetail/Littelfuse/0297010WXNV; ComponentLink4Description: Octopart; ComponentLink4URL: https://octopart.com/0297010.wxnv-littelfuse-566872
F2 = FUSE_HOLDER_3568: FUSE HOLDER BLADE; Mfr: Keystone; Voltage Rating: 500V; Current - Max: 30A; Operating Temperature: -50C - 145C; Created By: Pascal-Emmanuel Lachance
J1 = TERM_BLOCK-2
L1 L3 = IND_744314150: FIXED IND 1.5UH 13A 4.3 MOHM SMD; Mfr: Wurth; Resistance: 4.3mR; Operating Temperature: -40C - 150C; Created By: Pascal-Emmanuel Lachance; ComponentLink1Description: Digikey; ComponentLink1URL: https://www.digikey.ca/en/products/detail/w%C3%BCrth-elektronik/744314150/1638563; ComponentLink2Description: Mouser; ComponentLink2URL: https://www.mouser.ca/ProductDetail/Wurth-Elektronik/744314150; ComponentLink3Description: Datasheet; ComponentLink3URL: https://www.we-online.com/katalog/datasheet/744314150.pdf
L2 = IND_PLT10HH501100PNL: 2 Line Common Mode Choke Surface Mount 500 Ohms @ 10MHz 10A DCR 4.1mOhm; mfr: Murata; Impedance @ 10MHz: 500R; DC Resistance: 4.1mR; Voltage Rating: 100V; Rating: Automotive (AEC-Q200); Value: *; Current Rating: 10A; Operating Temperature: -55C - 105C; Created By: Pascal-Emmanuel Lachance; ComponentLink1Description: Datasheet; ComponentLink1URL: https://www.murata.com/en-eu/products/productdata/8796754935838/QFLB9101.pdf; ComponentLink2Description: Mfr page; ComponentLink2URL: https://www.murata.com/en-us/products/productdetail?partno=PLT10HH501100PN%23; ComponentLink3Description: Digikey; ComponentLink3URL: https://www.digikey.ca/en/products/detail/murata-electronics/PLT10HH501100PNL/6196056; ComponentLink4Description: Mouser; ComponentLink4URL: https://www.mouser.ca/ProductDetail/Murata-Electronics/PLT10HH501100PNL
L4 = IND_B82559B0203A016: 20uH Shielded 10A Inductor; Mfr: TDK; Material: Ferrite; Resistance: 12.1mR; Operating Temperature: -40C to 150C; Created By: Pascal-Emmanuel Lachance; Rating: AEC-Q200; ComponentLink1Description: Datasheet; ComponentLink1URL: https://media.digikey.com/pdf/Data%20Sheets/TDK%20PDFs/B82559BxA016_Series_DS.pdf; ComponentLink2Description: Digikey; ComponentLink2URL: https://www.digikey.ca/en/products/detail/epcos-tdk-electronics/B82559B0203A016/13165560; ComponentLink3Description: Mouser; ComponentLink3URL: https://www.mouser.ca/ProductDetail/EPCOS-TDK/B82559B0203A016; ComponentLink4Description: Mfr page; ComponentLink4URL: https://product.tdk.com/en/search/inductor/inductor/smd/info?part_no=B82559B0203A016; ComponentLink5Description: Octoparts; ComponentLink5URL: https://octopart.com/b82559b0203a016-epcos-111982021; Supplier 1: Digi-Key; Supplier Part Number 1: 495-B82559B0203A016CT-ND
Q1 = TRANS_FQD11P06TM: MOSFET P-CH 60V 9.4A DPAK; Mfr: ON Semiconductor; Rds ON: 185mOhms; Vgs: +-30V; Package / Case: DPAK; Vds: 60V; Operating Temperature: -55C - 150C; Digikey Part Number: FQD11P06TMCT-ND; ComponentLink1Description: Digikey; ComponentLink1URL: https://www.digikey.ca/en/products/detail/on-semiconductor/FQD11P06TM/1054286; ComponentLink2Description: Mouser; ComponentLink2URL: https://www.mouser.ca/ProductDetail/ON-Semiconductor-Fairchild/FQD11P06TM
R4 R34 = RESISTOR: Power: 1/16W; Tolerance: 10%; Automotive: *; Operating Temperature: *; # Digikey: *; ComponentLink1Description: Digikey; ComponentLink1URL: *; # Manufacturer: *; Package / Case: 0603
R35 = RESISTOR: Power: 2W; Tolerance: 1%; Automotive: *; Operating Temperature: *; # Digikey: *; ComponentLink1Description: Digikey; ComponentLink1URL: *; # Manufacturer: *; Package / Case: 2512
R36 R37 R41 = RESISTOR: Power: 1/10W; Tolerance: 10%; Automotive: *; Operating Temperature: *; # Digikey: *; ComponentLink1Description: Digikey; ComponentLink1URL: *; # Manufacturer: *; Package / Case: 0402
R38 R40 = RESISTOR: Power: 1/16W; Tolerance: 2%; Automotive: *; Operating Temperature: *; # Digikey: *; ComponentLink1Description: Digikey; ComponentLink1URL: *; # Manufacturer: *; Package / Case: 0603
R39 = RESISTOR: Power: 1/8W; Tolerance: 2%; Automotive: *; Operating Temperature: *; # Digikey: *; ComponentLink1Description: Digikey; ComponentLink1URL: *; # Manufacturer: *; Package / Case: 0603
TP6-TP8 TP24 TP25 = TESTPOINT: Test Point
U5 = IC_AOZ2255LQI-31: Buck Switching Regulator IC Positive Adjustable 0.6V 1 Output 12A 22-PowerVFQFN; Mfr: Alpha & Omega Semiconductor; Min Input Voltage: 6.5V; Max Input Voltage: 28V; Max Output Voltage: 23.8V; Min Output Voltage: 0.6V; Max Output Current: 12A; Operating Temperature: -40C to 85C; Package: PowerVFQFN-22 (4x4); Supplier 1: Digi-Key; Supplier Part Number 1: 785-AOZ2255LQI-31TR-ND; ComponentLink1Description: Digikey; ComponentLink1URL: https://www.digikey.ca/en/products/detail/alpha-omega-semiconductor-inc/AOZ2255LQI-31/12180202; ComponentLink2Description: Datasheet; ComponentLink2URL: http://aosmd.com/res/data_sheets/AOZ2255LQI-31.pdf; ComponentLink3Description: Octoparts; ComponentLink3URL: https://octopart.com/aoz2255lqi-31-alpha+%26+omega+semiconductor-109142852

## Sheet FPGA.SchDoc
size A4; SheetNumber: 6; SheetTotal: 18
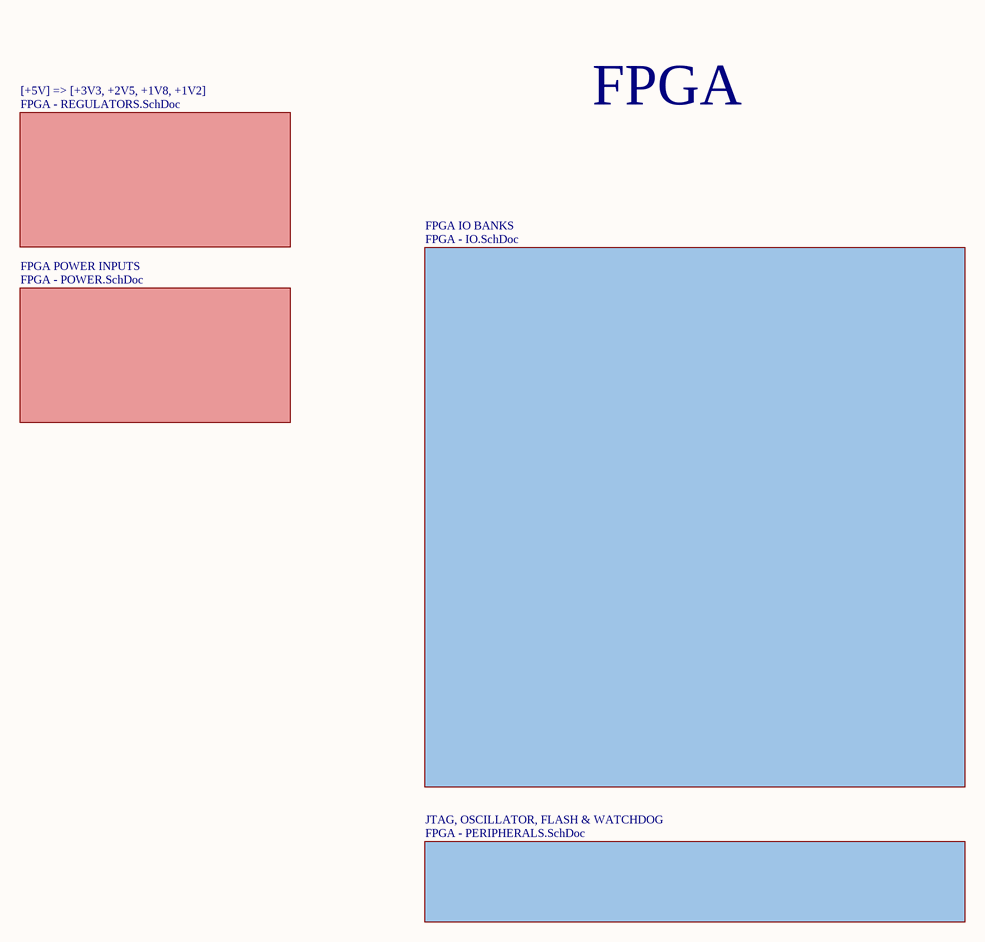
[diagram p5: FPGA.SchDoc]

### Sub-sheets
[+5V] => [+3V3, +2V5, +1V8, +1V2] = FPGA - REGULATORS.SchDoc: no entries
FPGA IO BANKS = FPGA - IO.SchDoc: no entries
FPGA POWER INPUTS = FPGA - POWER.SchDoc: no entries
JTAG, OSCILLATOR, FLASH & WATCHDOG = FPGA - PERIPHERALS.SchDoc: no entries

### Notes on the sheet
- FPGA

## Sheet FPGA - REGULATORS.SchDoc
size A3; DocumentNumber: 6; SheetNumber: 6; SheetTotal: 17
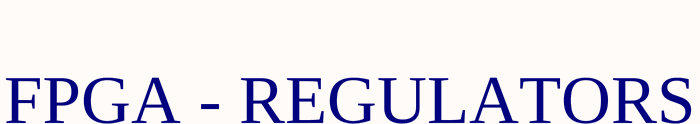
[diagram p6: FPGA - REGULATORS.SchDoc]

### Notes on the sheet
- FPGA - REGULATORS

## Sheet FPGA - POWER.SchDoc
size A3; DocumentNumber: 7; SheetNumber: 8; SheetTotal: 19
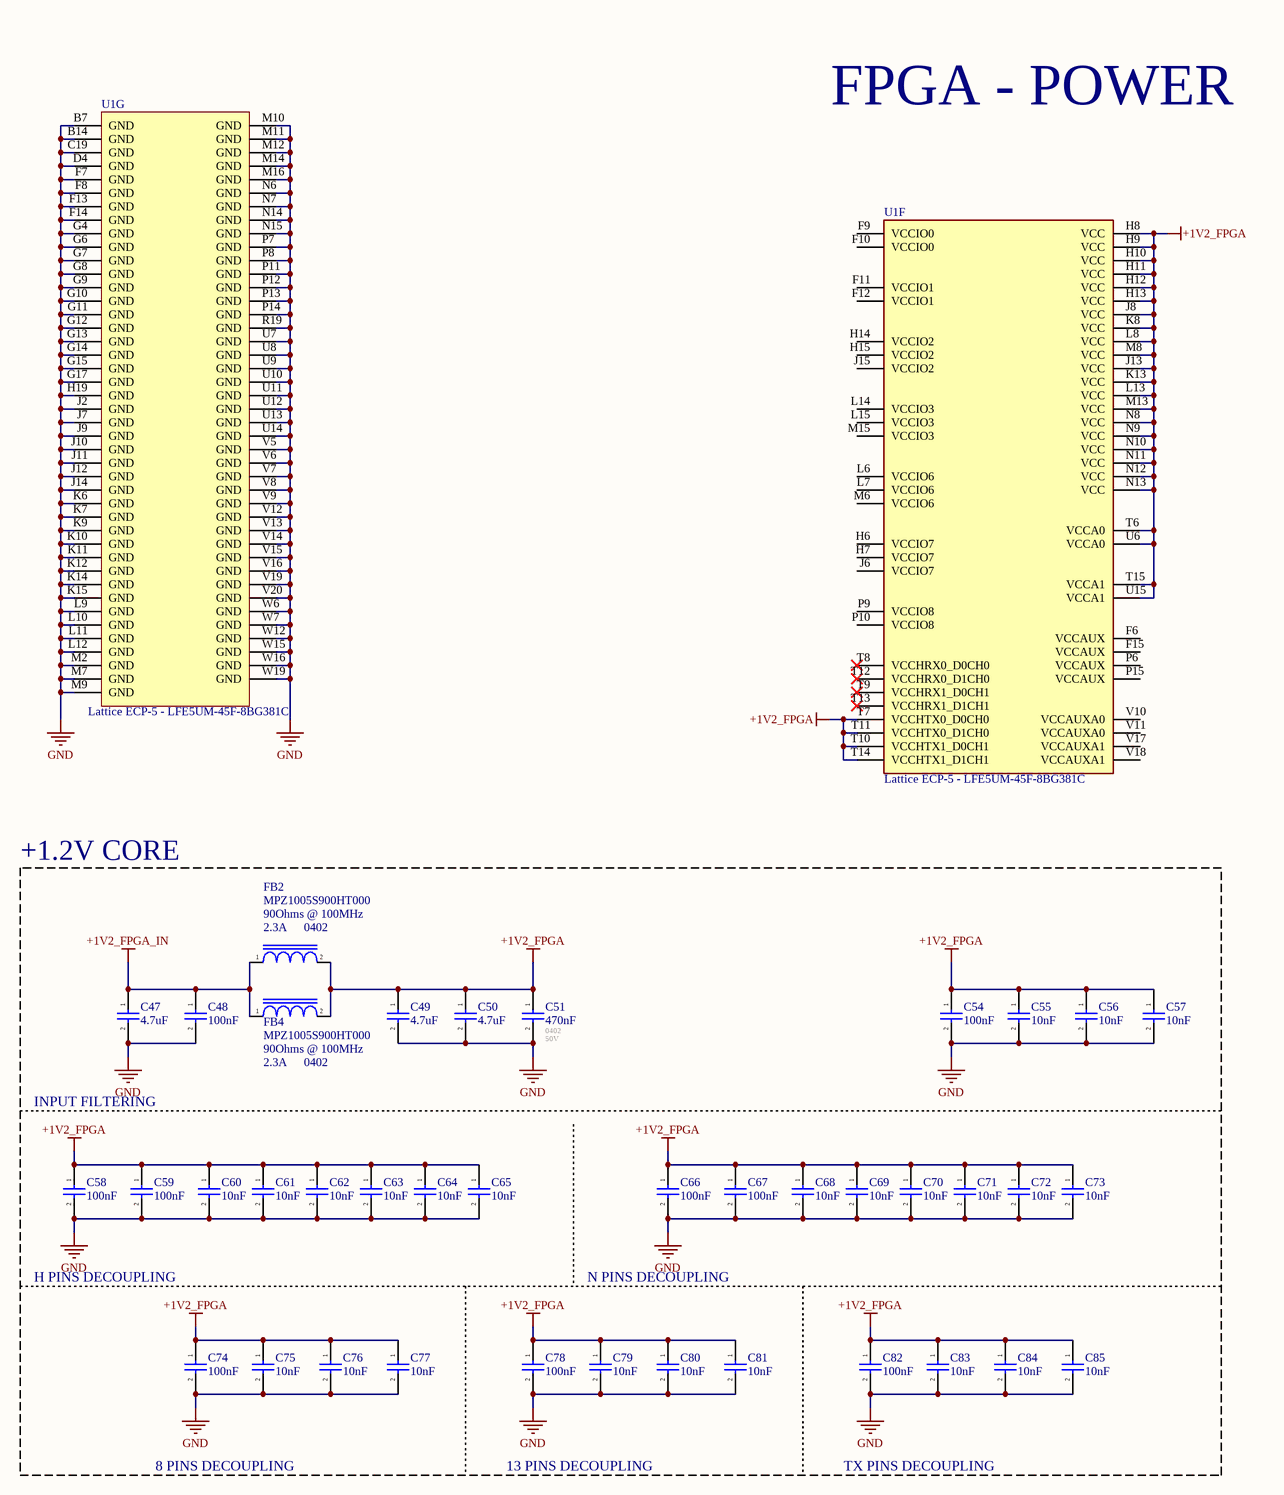
[diagram p7: FPGA - POWER.SchDoc]

### Parts
C47  4.7uF  [CAP_0805]
C48  100nF  [CAP_0402]
C49  4.7uF  [CAP_0805]
C50  4.7uF  [CAP_0805]
C51  470nF  Footprint: 0402  Voltage - Rated: 50V  [CAP_0402]
C54  100nF  [CAP_0402]
C55  10nF  [CAP_0201]
C56  10nF  [CAP_0201]
C57  10nF  [CAP_0201]
C58  100nF  [CAP_0402]
C59  100nF  [CAP_0402]
C60  10nF  [CAP_0201]
C61  10nF  [CAP_0201]
C62  10nF  [CAP_0201]
C63  10nF  [CAP_0201]
C64  10nF  [CAP_0201]
C65  10nF  [CAP_0201]
C66  100nF  [CAP_0402]
C67  100nF  [CAP_0402]
C68  10nF  [CAP_0201]
C69  10nF  [CAP_0201]
C70  10nF  [CAP_0201]
C71  10nF  [CAP_0201]
C72  10nF  [CAP_0201]
C73  10nF  [CAP_0201]
C74  100nF  [CAP_0402]
C75  10nF  [CAP_0201]
C76  10nF  [CAP_0201]
C77  10nF  [CAP_0201]
C78  100nF  [CAP_0402]
C79  10nF  [CAP_0201]
C80  10nF  [CAP_0201]
C81  10nF  [CAP_0201]
C82  100nF  [CAP_0402]
C83  10nF  [CAP_0201]
C84  10nF  [CAP_0201]
C85  10nF  [CAP_0201]
FB2  MPZ1005S900HT000  Impedance @ Freq: 90Ohms @ 100MHz  Package / Case: 0402  Current Rating: 2.3A  [IND_0402]
FB4  MPZ1005S900HT000  Impedance @ Freq: 90Ohms @ 100MHz  Package / Case: 0402  Current Rating: 2.3A  [IND_0402]
U1  Lattice ECP-5 - LFE5UM-45F-8BG381C  [CABGA-381]  (parts F,G of 7)

### Blocks framed on the sheet
+1.2V CORE: C47-C51 C54-C85 FB2 FB4

### Nets
+1V2_FPGA: C49.1 C50.1 C51.1 C54.1 C55.1 C56.1 C57.1 C58.1 C59.1 C60.1 C61.1 C62.1 C63.1 C64.1 C65.1 C66.1 C67.1 C68.1 C69.1 C70.1 C71.1 C72.1 C73.1 C74.1 C75.1 C76.1 C77.1 C78.1 C79.1 C80.1 C81.1 C82.1 C83.1 C84.1 C85.1 FB2.2 FB4.2 U1.H8(VCC) U1.H9(VCC) U1.H10(VCC) U1.H11(VCC) U1.H12(VCC) U1.H13(VCC) U1.J8(VCC) U1.J13(VCC) U1.K8(VCC) U1.K13(VCC) U1.L8(VCC) U1.L13(VCC) U1.M8(VCC) U1.M13(VCC) U1.N8(VCC) U1.N9(VCC) U1.N10(VCC) U1.N11(VCC) U1.N12(VCC) U1.N13(VCC) U1.T6(VCCA0) U1.T7(VCCHTX0_D0CH0) U1.T10(VCCHTX1_D0CH1) U1.T11(VCCHTX0_D1CH0) U1.T14(VCCHTX1_D1CH1) U1.T15(VCCA1) U1.U6(VCCA0) U1.U15(VCCA1)
+1V2_FPGA_IN: C47.1 C48.1 FB2.1 FB4.1
GND: C47.2 C48.2 C49.2 C50.2 C51.2 C54.2 C55.2 C56.2 C57.2 C58.2 C59.2 C60.2 C61.2 C62.2 C63.2 C64.2 C65.2 C66.2 C67.2 C68.2 C69.2 C70.2 C71.2 C72.2 C73.2 C74.2 C75.2 C76.2 C77.2 C78.2 C79.2 C80.2 C81.2 C82.2 C83.2 C84.2 C85.2 U1.B7(GND) U1.B14(GND) U1.C19(GND) U1.D4(GND) U1.F7(GND) U1.F8(GND) U1.F13(GND) U1.F14(GND) U1.G4(GND) U1.G6(GND) U1.G7(GND) U1.G8(GND) U1.G9(GND) U1.G10(GND) U1.G11(GND) U1.G12(GND) U1.G13(GND) U1.G14(GND) U1.G15(GND) U1.G17(GND) U1.H19(GND) U1.J2(GND) U1.J7(GND) U1.J9(GND) U1.J10(GND) U1.J11(GND) U1.J12(GND) U1.J14(GND) U1.K6(GND) U1.K7(GND) U1.K9(GND) U1.K10(GND) U1.K11(GND) U1.K12(GND) U1.K14(GND) U1.K15(GND) U1.L9(GND) U1.L10(GND) U1.L11(GND) U1.L12(GND) U1.M2(GND) U1.M7(GND) U1.M9(GND) U1.M10(GND) U1.M11(GND) U1.M12(GND) U1.M14(GND) U1.M16(GND) U1.N6(GND) U1.N7(GND) U1.N14(GND) U1.N15(GND) U1.P7(GND) U1.P8(GND) U1.P11(GND) U1.P12(GND) U1.P13(GND) U1.P14(GND) U1.R19(GND) U1.U7(GND) U1.U8(GND) U1.U9(GND) U1.U10(GND) U1.U11(GND) U1.U12(GND) U1.U13(GND) U1.U14(GND) U1.V5(GND) U1.V6(GND) U1.V7(GND) U1.V8(GND) U1.V9(GND) U1.V12(GND) U1.V13(GND) U1.V14(GND) U1.V15(GND) U1.V16(GND) U1.V19(GND) U1.V20(GND) U1.W6(GND) U1.W7(GND) U1.W12(GND) U1.W15(GND) U1.W16(GND) U1.W19(GND)

Not connected (* = marked no-connect by the designer): U1 F6(VCCAUX) F9(VCCIO0) F10(VCCIO0) F11(VCCIO1) F12(VCCIO1) F15(VCCAUX) H6(VCCIO7) H7(VCCIO7) H14(VCCIO2) H15(VCCIO2) J6(VCCIO7) J15(VCCIO2) L6(VCCIO6) L7(VCCIO6) L14(VCCIO3) L15(VCCIO3) M6(VCCIO6) M15(VCCIO3) P6(VCCAUX) P9(VCCIO8) P10(VCCIO8) P15(VCCAUX) T8(VCCHRX0_D0CH0)* T9(VCCHRX1_D0CH1)* T12(VCCHRX0_D1CH0)* T13(VCCHRX1_D1CH1)* V10(VCCAUXA0) V11(VCCAUXA0) V17(VCCAUXA1) V18(VCCAUXA1)

### Notes on the sheet
- FPGA - POWER
- INPUT FILTERING
- H PINS DECOUPLING
- N PINS DECOUPLING
- 8 PINS DECOUPLING
- 13 PINS DECOUPLING
- TX PINS DECOUPLING

### Library data of the parts
C47-C50 C54-C85 = CAP_CER: Generic SMT Ceramic Capacitor; Voltage - Rated: 25V; Operating Temperature: *; Tolerance: *; Mfr: *; ComponentLink1Description: Digikey; ComponentLink1URL: [Digikey Link]; Digikey Part No: *; ComponentLink2Description: Datasheet; ComponentLink2URL: [Datasheet Link]
  C47 C49 C50: Footprint: 0805
  C48 C54 C58 C59 C66 C67 C74 C78 C82: Footprint: 0402
  C55-C57 C60-C65 C68-C73 C75-C77 C79-C81 C83-C85: Footprint: 0201
C51 = CAP_CER: Generic SMT Ceramic Capacitor; Operating Temperature: *; Tolerance: *; Mfr: *; ComponentLink1Description: Digikey; ComponentLink1URL: [Digikey Link]; Digikey Part No: *; ComponentLink2Description: Datasheet; ComponentLink2URL: [Datasheet Link]
FB2 FB4 = IND_MPZ1005S900HT000: 90 Ohms @ 100 MHz 1 Power Line Ferrite Bead 0402 (1005 Metric) 2.3A 38mOhm; Resistance: 38mOhms; Operating Temperature: -55C - 125C; Rating: AEC-Q200
U1 = IC_LFE5UM-45F-8BG381C: IC FPGA 203 I/O 381CABGA; Mfr: Lattice Semiconductors; Supply Voltage: 1.045V - 1.115V; LABs/CLBs: 11000; Logic Elements: 44000; IOs: 203; RAM Bits: 1990656; Operating Temperature: 0C - 85C; Package / Case: 381-CABGA

## Sheet FPGA - IO.SchDoc
size A3; DocumentNumber: 9; SheetNumber: 10; SheetTotal: 19
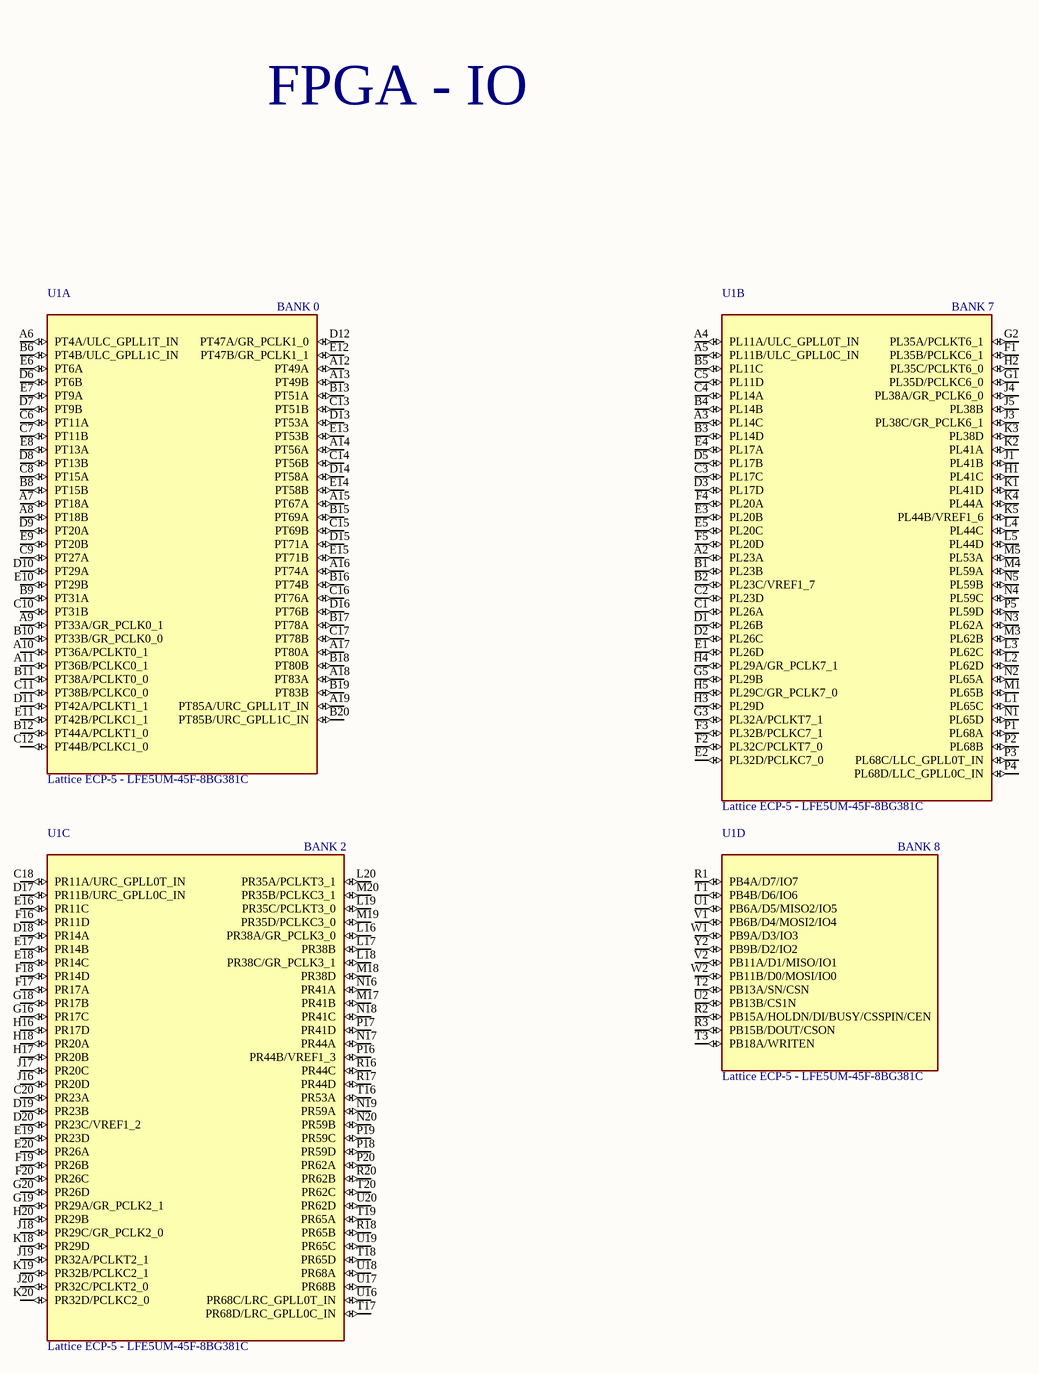
[diagram p8: FPGA - IO.SchDoc]

### Parts
U1  Lattice ECP-5 - LFE5UM-45F-8BG381C  [CABGA-381]  (parts A,B,C,D of 7)

### Nets

Not connected (* = marked no-connect by the designer): U1 A2(PL23A) A3(PL14C) A4(PL11A/ULC_GPLL0T_IN) A5(PL11B/ULC_GPLL0C_IN) A6(PT4A/ULC_GPLL1T_IN) A7(PT18A) A8(PT18B) A9(PT33A/GR_PCLK0_1) A10(PT36A/PCLKT0_1) A11(PT36B/PCLKC0_1) A12(PT49A) A13(PT49B) A14(PT56A) A15(PT67A) A16(PT74A) A17(PT80A) A18(PT83A) A19(PT85A/URC_GPLL1T_IN) B1(PL23B) B2(PL23C/VREF1_7) B3(PL14D) B4(PL14B) B5(PL11C) B6(PT4B/ULC_GPLL1C_IN) B8(PT15B) B9(PT31A) B10(PT33B/GR_PCLK0_0) B11(PT38A/PCLKT0_0) B12(PT44A/PCLKT1_0) B13(PT51A) B15(PT69A) B16(PT74B) B17(PT78A) B18(PT80B) B19(PT83B) B20(PT85B/URC_GPLL1C_IN) C1(PL26A) C2(PL23D) C3(PL17C) C4(PL14A) C5(PL11D) C6(PT11A) C7(PT11B) C8(PT15A) C9(PT27A) C10(PT31B) C11(PT38B/PCLKC0_0) C12(PT44B/PCLKC1_0) C13(PT51B) C14(PT56B) C15(PT69B) C16(PT76A) C17(PT78B) C18(PR11A/URC_GPLL0T_IN) C20(PR23A) D1(PL26B) D2(PL26C) D3(PL17D) D5(PL17B) D6(PT6B) D7(PT9B) D8(PT13B) D9(PT20A) D10(PT29A) D11(PT42A/PCLKT1_1) D12(PT47A/GR_PCLK1_0) D13(PT53A) D14(PT58A) D15(PT71A) D16(PT76B) D17(PR11B/URC_GPLL0C_IN) D18(PR14A) D19(PR23B) D20(PR23C/VREF1_2) E1(PL26D) E2(PL32D/PCLKC7_0) E3(PL20B) E4(PL17A) E5(PL20C) E6(PT6A) E7(PT9A) E8(PT13A) E9(PT20B) E10(PT29B) E11(PT42B/PCLKC1_1) E12(PT47B/GR_PCLK1_1) E13(PT53B) E14(PT58B) E15(PT71B) E16(PR11C) E17(PR14B) E18(PR14C) E19(PR23D) E20(PR26A) F1(PL35B/PCLKC6_1) F2(PL32C/PCLKT7_0) F3(PL32B/PCLKC7_1) F4(PL20A) F5(PL20D) F16(PR11D) F17(PR17A) F18(PR14D) F19(PR26B) F20(PR26C) G1(PL35D/PCLKC6_0) G2(PL35A/PCLKT6_1) G3(PL32A/PCLKT7_1) G5(PL29B) G16(PR17C) G18(PR17B) G19(PR29A/GR_PCLK2_1) G20(PR26D) H1(PL41C) H2(PL35C/PCLKT6_0) H3(PL29D) H4(PL29A/GR_PCLK7_1) H5(PL29C/GR_PCLK7_0) H16(PR17D) H17(PR20B) H18(PR20A) H20(PR29B) J1(PL41B) J3(PL38C/GR_PCLK6_1) J4(PL38A/GR_PCLK6_0) J5(PL38B) J16(PR20D) J17(PR20C) J18(PR29C/GR_PCLK2_0) J19(PR32A/PCLKT2_1) J20(PR32C/PCLKT2_0) K1(PL41D) K2(PL41A) K3(PL38D) K4(PL44A) K5(PL44B/VREF1_6) K18(PR29D) K19(PR32B/PCLKC2_1) K20(PR32D/PCLKC2_0) L1(PL65C) L2(PL62D) L3(PL62C) L4(PL44C) L5(PL44D) L16(PR38A/GR_PCLK3_0) L17(PR38B) L18(PR38C/GR_PCLK3_1) L19(PR35C/PCLKT3_0) L20(PR35A/PCLKT3_1) M1(PL65B) M3(PL62B) M4(PL59A) M5(PL53A) M17(PR41B) M18(PR38D) M19(PR35D/PCLKC3_0) M20(PR35B/PCLKC3_1) N1(PL65D) N2(PL65A) N3(PL62A) N4(PL59C) N5(PL59B) N16(PR41A) N17(PR44A) N18(PR41C) N19(PR59A) N20(PR59B) P1(PL68A) P2(PL68B) P3(PL68C/LLC_GPLL0T_IN) P4(PL68D/LLC_GPLL0C_IN) P5(PL59D) P16(PR44B/VREF1_3) P17(PR41D) P18(PR59D) P19(PR59C) P20(PR62A) R1(PB4A/D7/IO7) R2(PB15A/HOLDN/DI/BUSY/CSSPIN/CEN) R3(PB15B/DOUT/CSON) R16(PR44C) R17(PR44D) R18(PR65B) R20(PR62B) T1(PB4B/D6/IO6) T2(PB13A/SN/CSN) T3(PB18A/WRITEN) T16(PR53A) T17(PR68D/LRC_GPLL0C_IN) T18(PR65D) T19(PR65A) T20(PR62C) U1(PB6A/D5/MISO2/IO5) U2(PB13B/CS1N) U16(PR68C/LRC_GPLL0T_IN) U17(PR68B) U18(PR68A) U19(PR65C) U20(PR62D) V1(PB6B/D4/MOSI2/IO4) V2(PB11A/D1/MISO/IO1) W1(PB9A/D3/IO3) W2(PB11B/D0/MOSI/IO0) Y2(PB9B/D2/IO2)

### Notes on the sheet
- FPGA - IO
- (in symbol IC_LFE5UM-45F-8BG381C, part A) BANK 0
- (in symbol IC_LFE5UM-45F-8BG381C, part B) BANK 7
- (in symbol IC_LFE5UM-45F-8BG381C, part C) BANK 2
- (in symbol IC_LFE5UM-45F-8BG381C, part D) BANK 8

### Library data of the parts
U1 = IC_LFE5UM-45F-8BG381C: as U1 on sheet FPGA - POWER; Operating Temperature: 0C - 85C; Package / Case: 381-CABGA

## Sheet FPGA - PERIPHERALS.SchDoc
size A3; DocumentNumber: 8; SheetNumber: 9; SheetTotal: 19
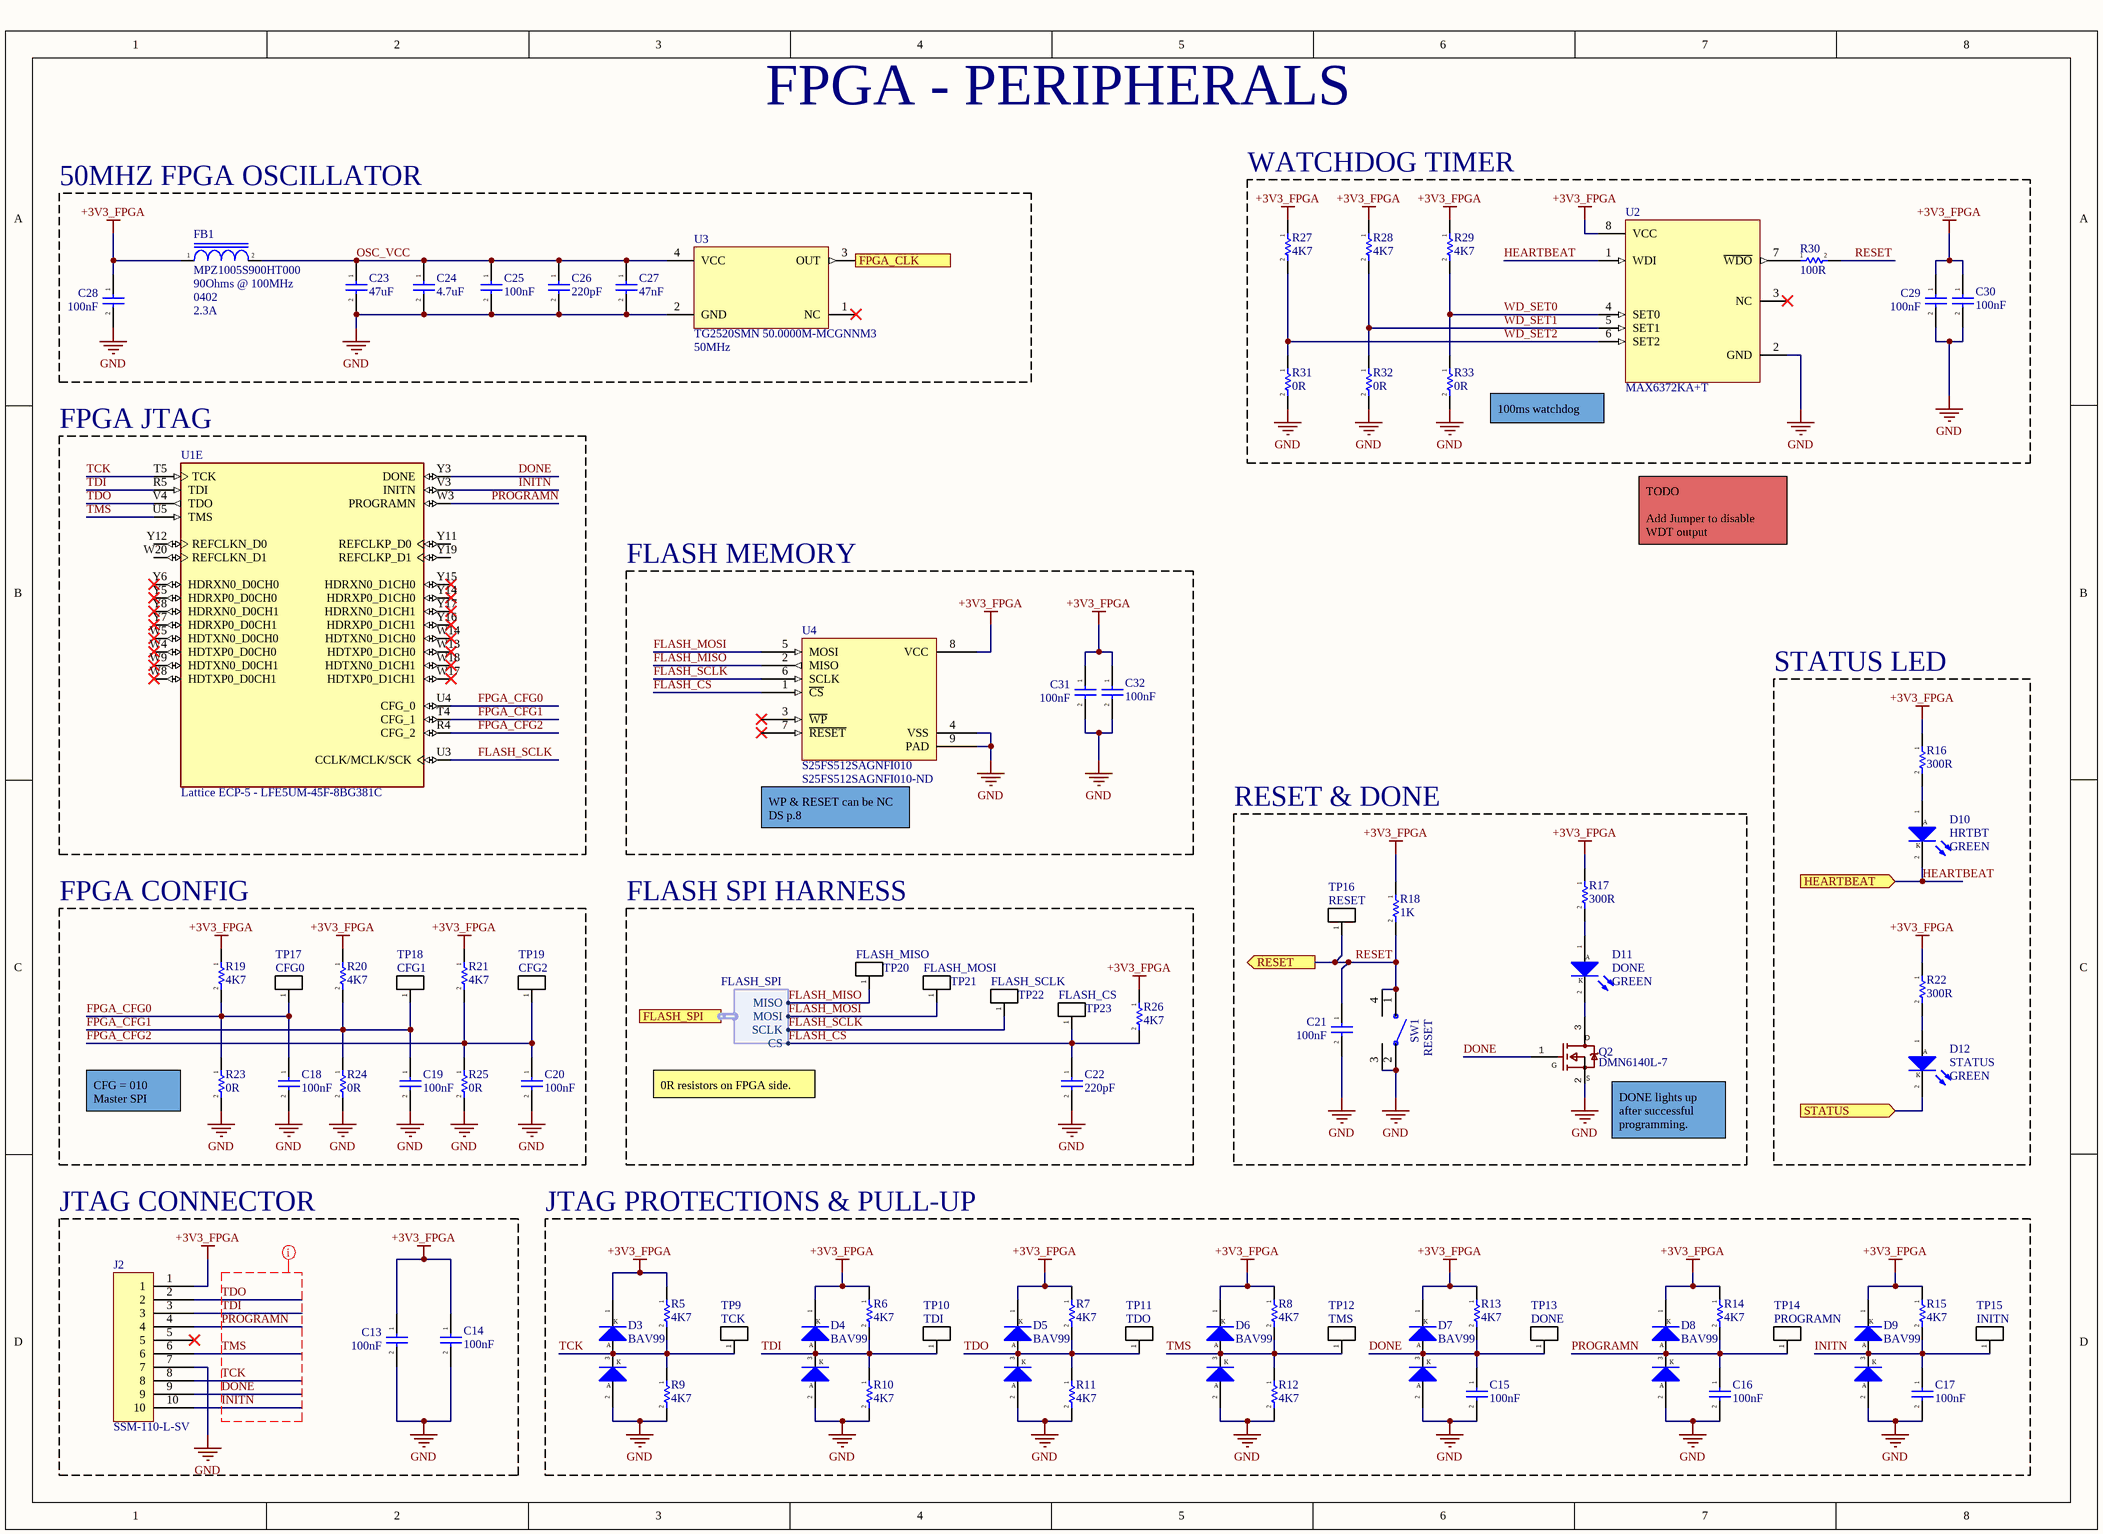
[diagram p9: FPGA - PERIPHERALS.SchDoc]

### Parts
C13  100nF  [CAP_0402]
C14  100nF  [CAP_0402]
C15  100nF  [CAP_0402]
C16  100nF  [CAP_0402]
C17  100nF  [CAP_0402]
C18  100nF  [CAP_0402]
C19  100nF  [CAP_0402]
C20  100nF  [CAP_0402]
C21  100nF  [CAP_0402]
C22  220pF  [CAP_0402]
C23  47uF  [CAP_1206]
C24  4.7uF  [CAP_0805]
C25  100nF  [CAP_0402]
C26  220pF  [CAP_0402]
C27  47nF  [CAP_0201]
C28  100nF  [CAP_0402]
C29  100nF  [CAP_0402]
C30  100nF  [CAP_0402]
C31  100nF  [CAP_0402]
C32  100nF  [CAP_0402]
D3  BAV99  [MMBD7000-7-F]
D4  BAV99  [MMBD7000-7-F]
D5  BAV99  [MMBD7000-7-F]
D6  BAV99  [MMBD7000-7-F]
D7  BAV99  [MMBD7000-7-F]
D8  BAV99  [MMBD7000-7-F]
D9  BAV99  [MMBD7000-7-F]
D10  HRTBT  Color: GREEN  [LED_0402]
D11  DONE  Color: GREEN  [LED_0402]
D12  STATUS  Color: GREEN  [LED_0402]
FB1  MPZ1005S900HT000  Impedance @ Freq: 90Ohms @ 100MHz  Package / Case: 0402  Current Rating: 2.3A  [IND_0402]
J2  SSM-110-L-SV  [SSM-110-L-SV]
Q2  DMN6140L-7  [SOT23-3]
R5  4K7  [RES_0603]
R6  4K7  [RES_0603]
R7  4K7  [RES_0603]
R8  4K7  [RES_0603]
R9  4K7  [RES_0603]
R10  4K7  [RES_0603]
R11  4K7  [RES_0603]
R12  4K7  [RES_0603]
R13  4K7  [RES_0603]
R14  4K7  [RES_0603]
R15  4K7  [RES_0603]
R16  300R  [RES_0603]
R17  300R  [RES_0603]
R18  1K  [RES_0603]
R19  4K7  [RES_0603]
R20  4K7  [RES_0603]
R21  4K7  [RES_0603]
R22  300R  [RES_0603]
R23  0R  [RES_0603]
R24  0R  [RES_0603]
R25  0R  [RES_0603]
R26  4K7  [RES_0603]
R27  4K7  [RES_0603]
R28  4K7  [RES_0603]
R29  4K7  [RES_0603]
R30  100R  [RES_0402]
R31  0R  [RES_0603]
R32  0R  [RES_0603]
R33  0R  [RES_0603]
SW1  RESET  [KMR621NGLFS]
TP9  TCK  [TP_PAD_SMALL]  (no BOM)
TP10  TDI  [TP_PAD_SMALL]  (no BOM)
TP11  TDO  [TP_PAD_SMALL]  (no BOM)
TP12  TMS  [TP_PAD_SMALL]  (no BOM)
TP13  DONE  [TP_PAD_TINY]  (no BOM)
TP14  PROGRAMN  [TP_PAD_TINY]  (no BOM)
TP15  INITN  [TP_PAD_TINY]  (no BOM)
TP16  RESET  [TP_PAD_SMALL]  (no BOM)
TP17  CFG0  [TP_PAD_TINY]  (no BOM)
TP18  CFG1  [TP_PAD_TINY]  (no BOM)
TP19  CFG2  [TP_PAD_TINY]  (no BOM)
TP20  FLASH_MISO  [TP_PAD_SMALL]  (no BOM)
TP21  FLASH_MOSI  [TP_PAD_SMALL]  (no BOM)
TP22  FLASH_SCLK  [TP_PAD_SMALL]  (no BOM)
TP23  FLASH_CS  [TP_PAD_SMALL]  (no BOM)
U1  Lattice ECP-5 - LFE5UM-45F-8BG381C  [CABGA-381]  (part E of 7)
U2  MAX6372KA+T  [SOT23-8]
U3  TG2520SMN 50.0000M-MCGNNM3  Frequency: 50MHz  [TG2520SMN]
U4  S25FS512SAGNFI010  Supplier Part Number 1: S25FS512SAGNFI010-ND  [s25FL256LAGNFV010]

### Blocks framed on the sheet
50MHZ FPGA OSCILLATOR: C23-C28 FB1 U3
WATCHDOG TIMER: C29 C30 R27-R33 U2
FPGA JTAG: U1
FLASH MEMORY: C31 C32 U4
STATUS LED: D10 D12 R16 R22
RESET & DONE: C21 D11 Q2 R17 R18 SW1 TP16
FPGA CONFIG: C18-C20 R19-R21 R23-R25 TP17-TP19
FLASH SPI HARNESS: C22 R26 TP20-TP23
JTAG CONNECTOR: C13 C14 J2
JTAG PROTECTIONS & PULL-UP: C15-C17 D3-D9 R5-R15 TP9-TP15

### Ports
FLASH_SPI (harness FLASH_SPI), FPGA_CLK (out), HEARTBEAT (in), RESET (out), STATUS (in)

### Harnesses
FLASH_SPI: MISO, MOSI, CS, SCLK

### Nets
+3V3_FPGA: C13.1 C14.1 C28.1 C29.1 C30.1 C31.1 C32.1 D3.1(K) D4.1(K) D5.1(K) D6.1(K) D7.1(K) D8.1(K) D9.1(K) FB1.1 J2.1 R5.1 R6.1 R7.1 R8.1 R13.1 R14.1 R15.1 R16.1 R17.1 R18.1 R19.1 R20.1 R21.1 R22.1 R26.1 R27.1 R28.1 R29.1 U2.8(VCC) U4.8(VCC)
GND: C13.2 C14.2 C15.2 C16.2 C17.2 C18.2 C19.2 C20.2 C21.2 C22.2 C23.2 C24.2 C25.2 C26.2 C27.2 C28.2 C29.2 C30.2 C31.2 C32.2 D3.2(K) D4.2(K) D5.2(K) D6.2(K) D7.2(K) D8.2(K) D9.2(K) J2.7 Q2.2 R9.2 R10.2 R11.2 R12.2 R23.2 R24.2 R25.2 R31.2 R32.2 R33.2 SW1.2 SW1.3 U2.2(GND) U3.2(GND) U4.4(VSS) U4.9(PAD)
DONE: C15.1 D7.3(A) J2.9 Q2.1 R13.2 TP13.1(A) U1.Y3(DONE)  [project net DONE_9]
FLASH_CS: C22.1 R26.2 TP23.1(A) U4.1(~{CS}) ; port FLASH_SPI.CS
FLASH_MISO: TP20.1(A) U4.2(MISO) ; port FLASH_SPI.MISO
FLASH_MOSI: TP21.1(A) U4.5(MOSI) ; port FLASH_SPI.MOSI
FLASH_SCLK: TP22.1(A) U1.U3(CCLK/MCLK/SCK) U4.6(SCLK) ; port FLASH_SPI.SCLK
FPGA_CFG0: C18.1 R19.2 R23.1 TP17.1(A) U1.U4(CFG_0)  [project net FPGA_CFG0_9]
FPGA_CFG1: C19.1 R20.2 R24.1 TP18.1(A) U1.T4(CFG_1)  [project net FPGA_CFG1_9]
FPGA_CFG2: C20.1 R21.2 R25.1 TP19.1(A) U1.R4(CFG_2)  [project net FPGA_CFG2_9]
FPGA_CLK: U3.3(OUT) ; port FPGA_CLK
HEARTBEAT: D10.2(K) U2.1(WDI) ; port HEARTBEAT
INITN: C17.1 D9.3(A) J2.10 R15.2 TP15.1(A) U1.V3(INITN)  [project net INITN_9]
OSC_VCC: C23.1 C24.1 C25.1 C26.1 C27.1 FB1.2 U3.4(VCC)  [project net OSC_VCC_9]
PROGRAMN: C16.1 D8.3(A) J2.4 R14.2 TP14.1(A) U1.W3(PROGRAMN)  [project net PROGRAMN_9]
RESET: C21.1 R18.2 R30.2 SW1.1 SW1.4 TP16.1(A) ; port RESET
STATUS: D12.2(K) ; port STATUS
TCK: D3.3(A) J2.8 R5.2 R9.1 TP9.1(A) U1.T5(TCK)  [project net TCK_9]
TDI: D4.3(A) J2.3 R6.2 R10.1 TP10.1(A) U1.R5(TDI)  [project net TDI_9]
TDO: D5.3(A) J2.2 R7.2 R11.1 TP11.1(A) U1.V4(TDO)  [project net TDO_9]
TMS: D6.3(A) J2.6 R8.2 R12.1 TP12.1(A) U1.U5(TMS)  [project net TMS_9]
WD_SET0: R29.2 R33.1 U2.4(SET0)  [project net WD_SET0_9]
WD_SET1: R28.2 R32.1 U2.5(SET1)  [project net WD_SET1_9]
WD_SET2: R27.2 R31.1 U2.6(SET2)  [project net WD_SET2_9]
NetD10_1: D10.1(A) R16.2
NetD11_1: D11.1(A) R17.2
NetD11_2: D11.2(K) Q2.3
NetD12_1: D12.1(A) R22.2
NetR30_1: R30.1 U2.7(~{WDO})

Not connected (* = marked no-connect by the designer): J2 5*; U1 W4(HDTXP0_D0CH0)* W5(HDTXN0_D0CH0)* W8(HDTXP0_D0CH1)* W9(HDTXN0_D0CH1)* W13(HDTXP0_D1CH0)* W14(HDTXN0_D1CH0)* W17(HDTXP0_D1CH1)* W18(HDTXN0_D1CH1)* W20(REFCLKN_D1) Y5(HDRXP0_D0CH0)* Y6(HDRXN0_D0CH0)* Y7(HDRXP0_D0CH1)* Y8(HDRXN0_D0CH1)* Y11(REFCLKP_D0) Y12(REFCLKN_D0) Y14(HDRXP0_D1CH0)* Y15(HDRXN0_D1CH0)* Y16(HDRXP0_D1CH1)* Y17(HDRXN0_D1CH1)* Y19(REFCLKP_D1); U2 3(NC)*; U3 1(NC)*; U4 3(~{WP})* 7(~{RESET})*

### Layout directives
net class JTAG: DONE, INITN, PROGRAMN, TCK, TDI, TDO, TMS

### Notes on the sheet
- FPGA - PERIPHERALS
- 100ms watchdog
- TODO
  Add Jumper to disable WDT output
- (near U4) WP & RESET can be NC
  DS p.8
- (near R23) CFG = 010
  Master SPI
- 0R resistors on FPGA side.
- (near Q2) DONE lights up after successful programming.
- (in symbol TRANS_DMN6140L-7) D; G; S

### Library data of the parts
C13-C32 = CAP_CER: as C47 on sheet FPGA - POWER; Operating Temperature: *; Tolerance: *; Mfr: *; ComponentLink1Description: Digikey; ComponentLink1URL: [Digikey Link]; Digikey Part No: *; ComponentLink2Description: Datasheet; ComponentLink2URL: [Datasheet Link]
  C13-C22 C25 C26 C28-C32: Footprint: 0402
  C23: Footprint: 1206
  C24: Footprint: 0805
  C27: Footprint: 0201
D3-D9 = DIODE_BAV99: DIODE ARRAY GP 75V 300MA SOT23-3; Mfr: Taiwan Semiconductor Corporation; Diode Configuration: 1 Pair Series Connection; Current: 200mA; DC Reverse Voltage: 70V; Operating Temperature: -55C - 150C; Footprint: SOT-23
D10-D12 = DIODE_LED: Generic LED; Forward Voltage: *; Wavelength: *
FB1 = IND_MPZ1005S900HT000: as FB2 on sheet FPGA - POWER; Operating Temperature: -55C - 125C; Rating: AEC-Q200
J2 = CONN_SSM-110-L-SV: CONN RCPT 10POS 0.1 GOLD SMD; Mfr: Samtec Inc.; Number of positions: 10; Pitch: 100mil; Current: 5.2A / contact; Insulation Height: 290mil; Operating Temperature: -55C - 125C; Supplier 1: Digi-Key; Supplier Part Number 1: SAM1148-10-ND
Q2 = TRANS_DMN6140L-7: N-Channel 60 V 1.6A (Ta) 700mW (Ta) Surface Mount SOT-23; Mfr: Diodes Incorporated; Vds: 60V; Rds ON: 140mR; Vgs: 3V; Package / Case: SOT-23; Operating Temperature: -55C - 150C; Current: 1.6A
R5-R15 R19-R21 R26-R29 = RESISTOR: Power: 1/16W; Tolerance: 10%; Automotive: *; Operating Temperature: *; # Digikey: *; ComponentLink1Description: Digikey; ComponentLink1URL: *; # Manufacturer: *; Package / Case: 0603
R16 R17 R22 = RESISTOR: Power: 1/8W; Tolerance: 2%; Automotive: *; Operating Temperature: *; # Digikey: *; ComponentLink1Description: Digikey; ComponentLink1URL: *; # Manufacturer: *; Package / Case: 0603
R18 = RESISTOR: Power: 1/8W; Tolerance: 5%; Automotive: *; Operating Temperature: *; # Digikey: *; ComponentLink1Description: Digikey; ComponentLink1URL: *; # Manufacturer: *; Package / Case: 0603
R23-R25 R30-R33 = RESISTOR: Power: 1/8W; Tolerance: 10%; Automotive: *; Operating Temperature: *; # Digikey: *; ComponentLink1Description: Digikey; ComponentLink1URL: *; # Manufacturer: *
  R23-R25 R31-R33: Package / Case: 0603
  R30: Package / Case: 0402
SW1 = SW_KMR621NG_LFS: Tactile Switch SPST-NO Top Actuated Surface Mount; Mfr: C&K; Alternative Part: KMR641NG ULC LFS; Contact Rating: 50mA @ 32V; Type: SPST-NO; Operating Temperature: -40C to 85C; Supplier 1: Newark; Supplier Part Number 1: 35AH0964; Digikey #: CKN10686CT-ND; ComponentLink1Description: Digikey; ComponentLink1URL: https://www.digikey.ca/en/products/detail/c-k/KMR641NG-ULC-LFS/6035352; ComponentLink2Description: Datasheet; ComponentLink2URL: https://www.ckswitches.com/media/1907/kmr6.pdf
TP9-TP23 = TESTPOINT: Test Point
U1 = IC_LFE5UM-45F-8BG381C: as U1 on sheet FPGA - POWER; Operating Temperature: 0C - 85C; Package / Case: 381-CABGA
U2 = IC_MAX6372KA-T: Watchdog Push-Pull, Totem Pole 1 Channel SOT-23-8; Mfr: Maxim Integrated; Timeout: Adjustable 1ms - 10s; Temperature: -40C - 125C; Supplier 1: Mouser; ComponentLink1Description: Digikey; ComponentLink1URL: https://www.digikey.ca/en/products/detail/analog-devices-inc-maxim-integrated/MAX6372KA-T/1518602; ComponentLink2Description: Datasheet; ComponentLink2URL: https://datasheets.maximintegrated.com/en/ds/MAX6369-MAX6374.pdf; Supplier Part Number 1: 700-MAX6372KAT
U3 = IC_TG2520SMN_50.0000M-MCGNNM3: 50 MHz TCXO Clipped Sine Wave Oscillator 2.8V ~ 3.3V - 4-SMD, No Lead; Mfr: EPSON; Supply Voltage: 2.8V - 3.3V; Frequency Stability: 500ppb; Supply Current: 2mA; Type: TCXO; Operating Temperature: -40C to 85C; Supplier 1: Digi-Key; Supplier Part Number 1: 114-TG2520SMN50.0000M-MCGNNM3CT-ND; ComponentLink1Description: Digikey; ComponentLink1URL: https://www.digikey.ca/en/products/detail/epson/TG2520SMN-50-0000M-MCGNNM3/13151939; ComponentLink2Description: Datasheet; ComponentLink2URL: https://support.epson.biz/td/api/doc_check.php?dl=brief_TG2520SMN&lang=en; ComponentLink3Description: Manufacturer; ComponentLink3URL: https://www5.epsondevice.com/en/products/tcxo/tg2520smn.html
U4 = IC_S25FS512SAGNFI010: FLASH - NOR Memory IC 512Mb (64M x 8) SPI - Quad I/O, QPI 133 MHz 8-WSON (6x8); Mfr: Cypress; Memory Size: 512Mbits; Clock Frequency: 133MHz; Supply Voltage: 2.7V - 3.6V; Supplier 1: Digi-Key; Package: WSON-8 (8x6); Operating Temperature: -40C - 105C; ComponentLink1Description: Digikey; ComponentLink1URL: https://www.digikey.ca/en/products/detail/cypress-semiconductor-corp/S25FS512SAGNFI010/6596268; ComponentLink2Description: Datasheet; ComponentLink2URL: https://www.infineon.com/dgdl/Infineon-S25FS512S_512_Mb_1.8_V_Serial_Peripheral_Interface_with_Multi-I_O_Non-Volatile_Flash-DataSheet-v14_00-EN.pdf?fileId=8ac78c8c7d0d8da4017d0ed681a356fe&utm_source=cypress&utm_medium=referral&utm_campaign=202110_globe_en_all_integration-files

## Sheet DDR3.SchDoc
size A4; SheetNumber: 11; SheetTotal: 19
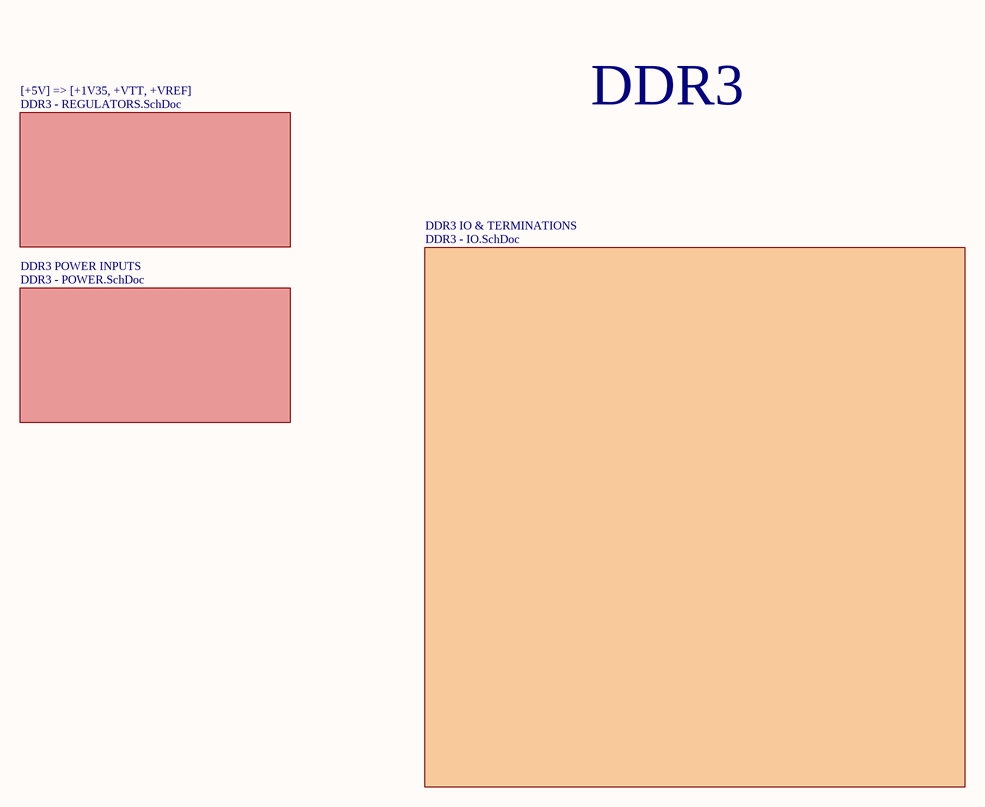
[diagram p10: DDR3.SchDoc]

### Sub-sheets
[+5V] => [+1V35, +VTT, +VREF] = DDR3 - REGULATORS.SchDoc: no entries
DDR3 IO & TERMINATIONS = DDR3 - IO.SchDoc: no entries
DDR3 POWER INPUTS = DDR3 - POWER.SchDoc: no entries

### Notes on the sheet
- DDR3

## Sheet DDR3 - REGULATORS.SchDoc
size A3; DocumentNumber: 10; SheetNumber: 10; SheetTotal: 17
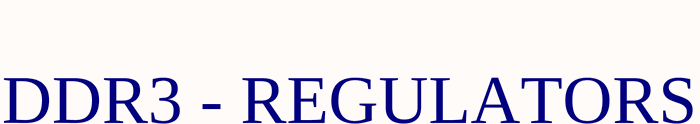
[diagram p11: DDR3 - REGULATORS.SchDoc]

### Notes on the sheet
- DDR3 - REGULATORS

## Sheet DDR3 - POWER.SchDoc
size A4; DocumentNumber: 11; SheetNumber: 11; SheetTotal: 17
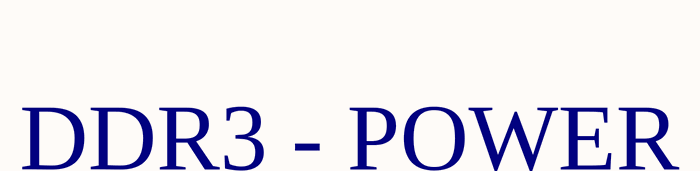
[diagram p12: DDR3 - POWER.SchDoc]

### Notes on the sheet
- DDR3 - POWER

## Sheet DDR3 - IO.SchDoc
size A3; DocumentNumber: 12; SheetNumber: 12; SheetTotal: 17
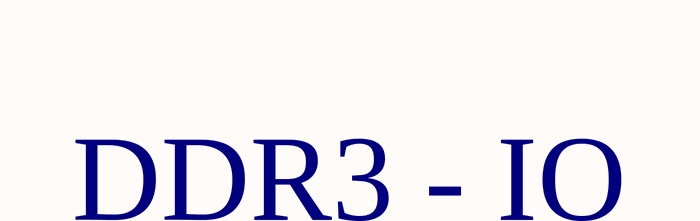
[diagram p13: DDR3 - IO.SchDoc]

### Notes on the sheet
- DDR3 - IO

## Sheet TELEMETRY.SchDoc
size A4; DocumentNumber: 13; SheetNumber: 15; SheetTotal: 19
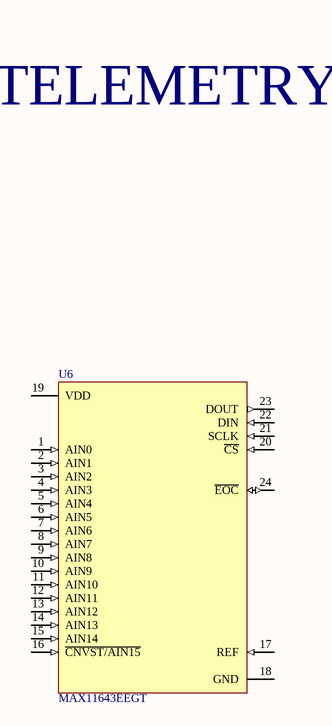
[diagram p14: TELEMETRY.SchDoc]

### Parts
U6  MAX11643EEGT  [MAX11643EEG+]

### Nets

Not connected (* = marked no-connect by the designer): U6 1(AIN0) 2(AIN1) 3(AIN2) 4(AIN3) 5(AIN4) 6(AIN5) 7(AIN6) 8(AIN7) 9(AIN8) 10(AIN9) 11(AIN10) 12(AIN11) 13(AIN12) 14(AIN13) 15(AIN14) 16(~{CNVST/AIN15}) 17(REF) 18(GND) 19(VDD) 20(~{CS}) 21(SCLK) 22(DIN) 23(DOUT) 24(~{EOC})

### Notes on the sheet
- TELEMETRY

### Library data of the parts
U6 = IC_MAX11643EEGT: 8 Bit Analog to Digital Converter 16 Input 1 SAR 24-QSOP; Mfr: Maxim Integrated; Number of Bits: 8; Sampling rate: 300k; Number of inputs: 16; Input Type: Single Ended; Internal Reference: 2.5V; Internal Clock: 4.4MHz; Voltage Supply: 2.7V - 3.6V; Operating Temperature: -40C to 85C; Supplier 1: Mouser; Supplier Part Number 1: 700-MAX11643EEG+; ComponentLink1Description: Digikey; ComponentLink1URL: https://www.digikey.ca/en/products/detail/analog-devices-inc-maxim-integrated/MAX11643EEG/2793247; ComponentLink2Description: Datasheet; ComponentLink2URL: https://datasheets.maximintegrated.com/en/ds/MAX11638-MAX11643.pdf

## Sheet QRNG.SchDoc
size A4; DocumentNumber: 14; SheetNumber: 16; SheetTotal: 19
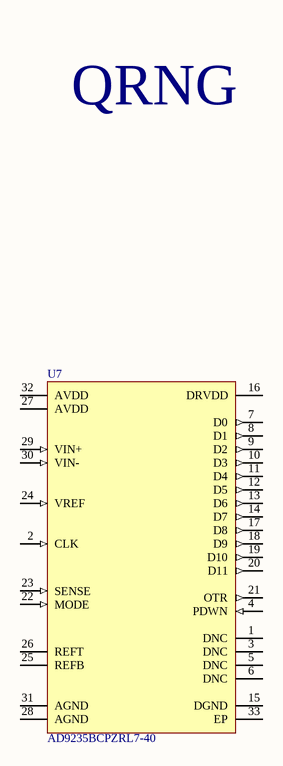
[diagram p15: QRNG.SchDoc]

### Parts
U7  AD9235BCPZRL7-40  [AD9235BCPZRL7-40]

### Nets

Not connected (* = marked no-connect by the designer): U7 1(DNC) 2(CLK) 3(DNC) 4(PDWN) 5(DNC) 6(DNC) 7(D0) 8(D1) 9(D2) 10(D3) 11(D4) 12(D5) 13(D6) 14(D7) 15(DGND) 16(DRVDD) 17(D8) 18(D9) 19(D10) 20(D11) 21(OTR) 22(MODE) 23(SENSE) 24(VREF) 25(REFB) 26(REFT) 27(AVDD) 28(AGND) 29(VIN+) 30(VIN-) 31(AGND) 32(AVDD) 33(EP)

### Notes on the sheet
- QRNG

### Library data of the parts
U7 = IC_AD9235BCPZRL7-40: Parallel 12 Bit ADC 40MSPS 1 Input Diff; Mfr: Analog Devices; Number of Bits: 12; Input Type: Differential / Single-Ended; Internal Reference: 500mV to 1V adj; Supply (Analog): 2.7V to 3.6V; Supply (Digital): 2.25V to 3.6V; Sample Rate: 40MSPS; Data Interface: Parallel; Operating Temperature: -40C to 85C; Created By: Pascal-Emmanuel Lachance; Supplier 1: Digi-Key; Supplier Part Number 1: 505-AD9235BCPZRL7-40CT-ND; ComponentLink1Description: Datasheet; ComponentLink1URL: https://www.analog.com/media/en/technical-documentation/data-sheets/AD9235.pdf; ComponentLink2Description: Digikey; ComponentLink2URL: https://www.digikey.ca/en/products/detail/analog-devices-inc/AD9235BCPZRL7-40/996171; ComponentLink3Description: Mouser; ComponentLink3URL: https://www.mouser.com/ProductDetail/Analog-Devices/AD9235BCPZRL7-40; ComponentLink4Description: Arrow; ComponentLink4URL: https://www.arrow.com/en/products/ad9235bcpzrl7-40/analog-devices; ComponentLink5Description: Octoparts; ComponentLink5URL: https://octopart.com/ad9235bcpzrl7-40-analog+devices-404113; ComponentLink6Description: Mfr Page; ComponentLink6URL: https://www.analog.com/en/products/ad9235.html

## Sheet DEBUG.SchDoc
size A3; DocumentNumber: 17; SheetNumber: 17; SheetTotal: 17
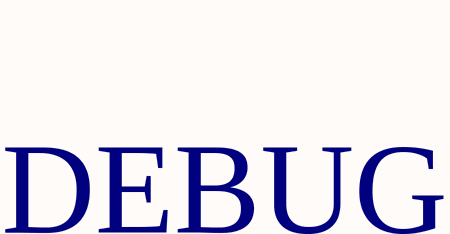
[diagram p16: DEBUG.SchDoc]

### Notes on the sheet
- DEBUG

## Sheet SATA.SchDoc
size A4; DocumentNumber: 15; SheetNumber: 17; SheetTotal: 19
Used 2 times, as channels INSERT CRYPTUS LOGO HERE/SATA1, INSERT CRYPTUS LOGO HERE/SATA2. Parts and nets are listed once, with the designators drawn on the sheet.
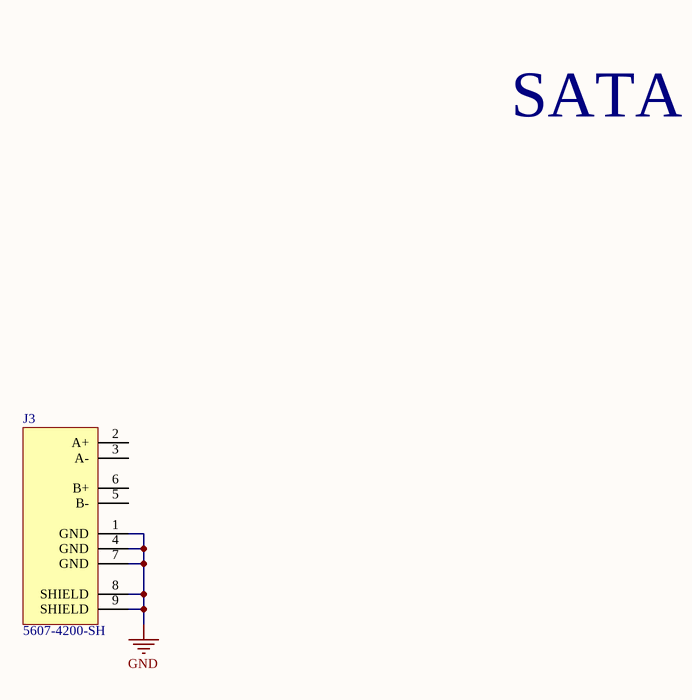
[diagram p17: SATA.SchDoc]

### Parts
J3  5607-4200-SH  [5607-4200-SH]

### Nets
GND: J3.1(GND) J3.4(GND) J3.7(GND) J3.8(SHIELD) J3.9(SHIELD)

Not connected (* = marked no-connect by the designer): J3 2(A+) 3(A-) 5(B-) 6(B+)

### Channels
INSERT CRYPTUS LOGO HERE/SATA1: designators end in _1
INSERT CRYPTUS LOGO HERE/SATA2: designators end in _2

### Notes on the sheet
- SATA

### Library data of the parts
J3 = CONN_5607-4200-SH: 7 Position SATA Plug Connector Solder Surface Mount, Right Angle; Mfr: 3M; Supplier 1: Digi-Key; Supplier Part Number 1: 3M5561-ND; Connector Type: SATA; Mounting Type: Right Angle; ComponentLink1Description: Octoparts; ComponentLink1URL: https://octopart.com/5607-4200-sh-3m-656899; Created By: Pascal-Emmanuel Lachance; ComponentLink2Description: Digikey; ComponentLink2URL: https://www.digikey.ca/en/products/detail/3m/5607-4200-SH/1207102; ComponentLink3Description: Mouser; ComponentLink3URL: https://www.mouser.ca/ProductDetail/3M-Electronic-Solutions-Division/5607-4200-SH; ComponentLink4Description: Newark; ComponentLink4URL: https://canada.newark.com/3m/5607-4200-sh/sata-connector-plug-7-position/dp/18M6678; ComponentLink5Description: Datasheet; ComponentLink5URL: https://multimedia.3m.com/mws/media/412906O/3mtm-serial-adv-tech-attachment-sata-connector-cd2108.pdf